# Altium project ZYNQ_JTY_16CH.PrjPcb (part 1 of 2)
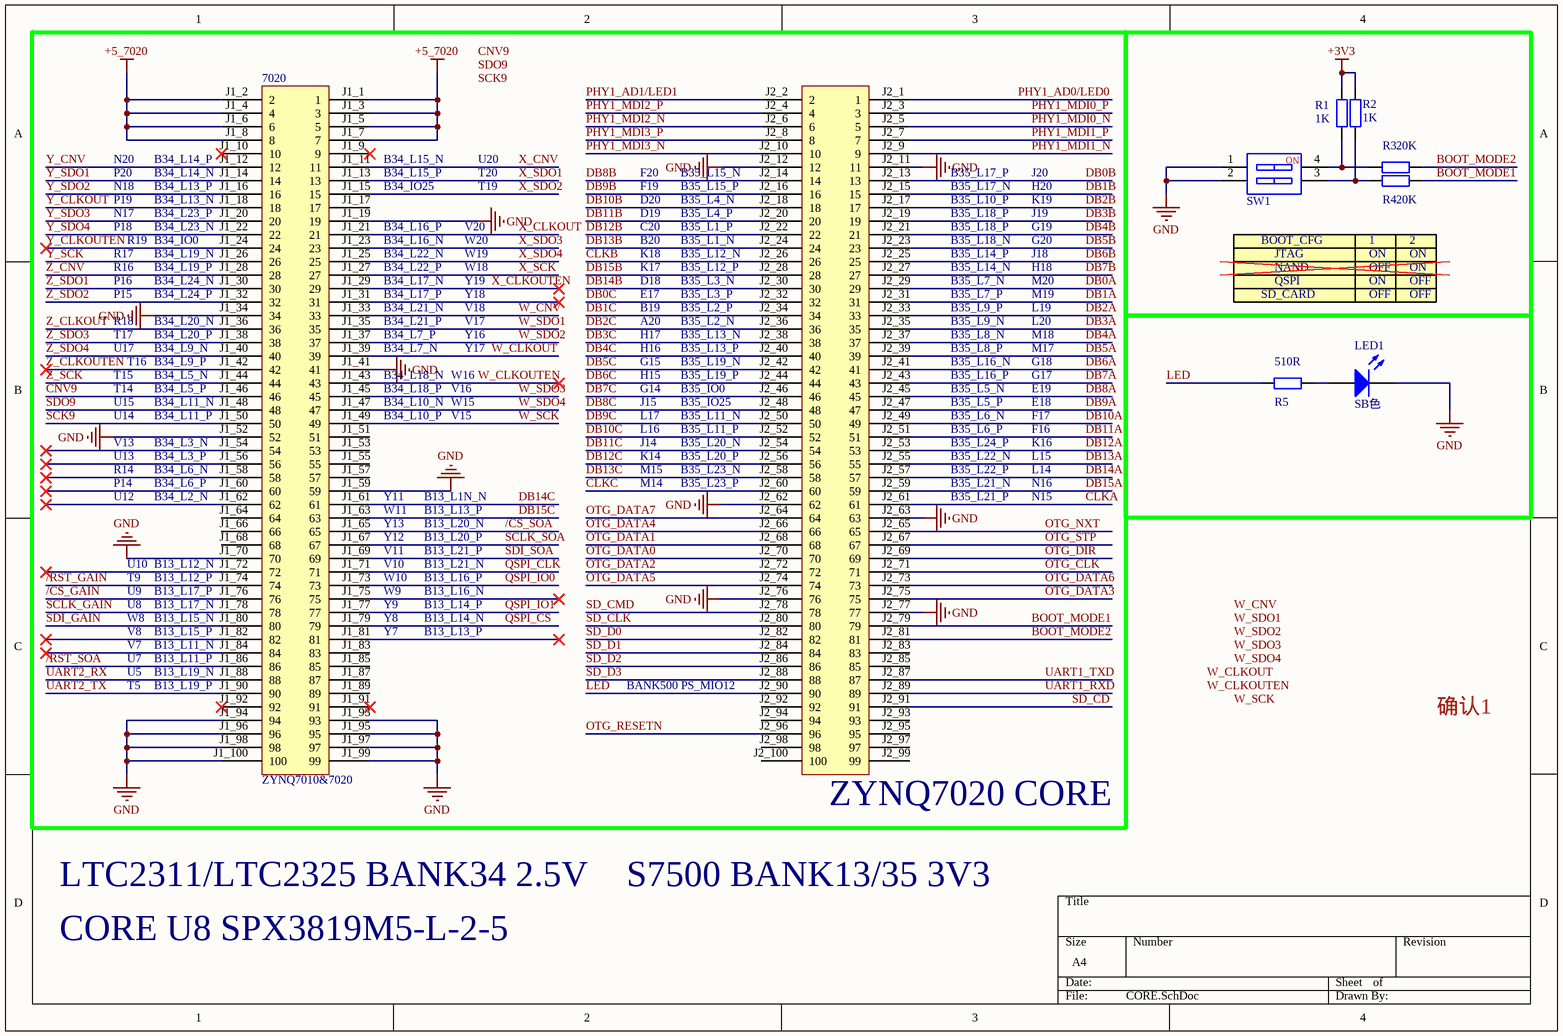
[diagram p0: CORE.SchDoc]
6 sheets, 525 parts. Net scope: global (net labels, ports and power ports of the same name join across sheets).
Board file: ZYNQ_JTY_16CH.PcbDoc
Sheets:
  CORE.SchDoc
  S7500_Drv.SchDoc
  PD.SchDoc
  PWR.SchDoc
  USB_HOST.SchDoc
  NET&232&USART&SD&FLASH.SchDoc

## Sheet CORE.SchDoc
size A4; SheetNumber: 1; SheetTotal: 6

### Parts
7020  ZYNQ7010&7020  [ZYNQ7010&7020_CB]
LED1  SB色  [LED0603_B]
R1  1K  [R0402_L]
R2  1K  [R0402_L]
R3  20K  [R0402_L]
R4  20K  [R0402_L]
R5  510R  [R0603_L]
SW1  DIP-SW-2P  [SW DIP-2P]  (value not drawn)

### Blocks framed on the sheet
ZYNQ7020 CORE: 7020

### Nets
+3V3: R1.2 R2.2
+5_7020: 7020.J1_1(1) 7020.J1_2(2) 7020.J1_3(3) 7020.J1_4(4) 7020.J1_5(5) 7020.J1_6(6) 7020.J1_7(7) 7020.J1_8(8)
GND: 7020.J1_19(19) 7020.J1_34(34) 7020.J1_41(41) 7020.J1_52(52) 7020.J1_59(59) 7020.J1_70(70) 7020.J1_93(93) 7020.J1_94(94) 7020.J1_95(95) 7020.J1_96(96) 7020.J1_97(97) 7020.J1_98(98) 7020.J1_99(99) 7020.J1_100(100) 7020.J2_11(11) 7020.J2_12(12) 7020.J2_62(62) 7020.J2_63(63) 7020.J2_76(76) 7020.J2_77(77) LED1.2(K) SW1.1 SW1.2
/CS_GAIN: 7020.J1_76(76)
/CS_SOA: 7020.J1_65(65)
/RST_GAIN: 7020.J1_74(74)
/RST_SOA: 7020.J1_86(86)
BOOT_MODE1: 7020.J2_79(79) R4.2
BOOT_MODE2: 7020.J2_81(81) R3.2
CLKA: 7020.J2_61(61)
CLKB: 7020.J2_26(26)
CLKC: 7020.J2_60(60)
CNV9: 7020.J1_46(46)
DB0A: 7020.J2_29(29)
DB0B: 7020.J2_13(13)
DB0C: 7020.J2_32(32)
DB1A: 7020.J2_31(31)
DB1B: 7020.J2_15(15)
DB1C: 7020.J2_34(34)
DB2A: 7020.J2_33(33)
DB2B: 7020.J2_17(17)
DB2C: 7020.J2_36(36)
DB3A: 7020.J2_35(35)
DB3B: 7020.J2_19(19)
DB3C: 7020.J2_38(38)
DB4A: 7020.J2_37(37)
DB4B: 7020.J2_21(21)
DB4C: 7020.J2_40(40)
DB5A: 7020.J2_39(39)
DB5B: 7020.J2_23(23)
DB5C: 7020.J2_42(42)
DB6A: 7020.J2_41(41)
DB6B: 7020.J2_25(25)
DB6C: 7020.J2_44(44)
DB7A: 7020.J2_43(43)
DB7B: 7020.J2_27(27)
DB7C: 7020.J2_46(46)
DB8A: 7020.J2_45(45)
DB8B: 7020.J2_14(14)
DB8C: 7020.J2_48(48)
DB9A: 7020.J2_47(47)
DB9B: 7020.J2_16(16)
DB9C: 7020.J2_50(50)
DB10A: 7020.J2_49(49)
DB10B: 7020.J2_18(18)
DB10C: 7020.J2_52(52)
DB11A: 7020.J2_51(51)
DB11B: 7020.J2_20(20)
DB11C: 7020.J2_54(54)
DB12A: 7020.J2_53(53)
DB12B: 7020.J2_22(22)
DB12C: 7020.J2_56(56)
DB13A: 7020.J2_55(55)
DB13B: 7020.J2_24(24)
DB13C: 7020.J2_58(58)
DB14A: 7020.J2_57(57)
DB14B: 7020.J2_30(30)
DB14C: 7020.J1_61(61)
DB15A: 7020.J2_59(59)
DB15B: 7020.J2_28(28)
DB15C: 7020.J1_63(63)
LED: 7020.J2_90(90) R5.1
OTG_CLK: 7020.J2_71(71)
OTG_DATA0: 7020.J2_70(70)
OTG_DATA1: 7020.J2_68(68)
OTG_DATA2: 7020.J2_72(72)
OTG_DATA3: 7020.J2_75(75)
OTG_DATA4: 7020.J2_66(66)
OTG_DATA5: 7020.J2_74(74)
OTG_DATA6: 7020.J2_73(73)
OTG_DATA7: 7020.J2_64(64)
OTG_DIR: 7020.J2_69(69)
OTG_NXT: 7020.J2_65(65)
OTG_RESETN: 7020.J2_96(96)
OTG_STP: 7020.J2_67(67)
PHY1_AD0/LED0: 7020.J2_1(1)
PHY1_AD1/LED1: 7020.J2_2(2)
PHY1_MDI0_N: 7020.J2_5(5)
PHY1_MDI0_P: 7020.J2_3(3)
PHY1_MDI1_N: 7020.J2_9(9)
PHY1_MDI1_P: 7020.J2_7(7)
PHY1_MDI2_N: 7020.J2_6(6)
PHY1_MDI2_P: 7020.J2_4(4)
PHY1_MDI3_N: 7020.J2_10(10)
PHY1_MDI3_P: 7020.J2_8(8)
QSPI_CLK: 7020.J1_71(71)
QSPI_CS: 7020.J1_79(79)
QSPI_IO0: 7020.J1_73(73)
QSPI_IO1: 7020.J1_77(77)
SCK9: 7020.J1_50(50)
SCLK_GAIN: 7020.J1_78(78)
SCLK_SOA: 7020.J1_67(67)
SD_CD: 7020.J2_91(91)
SD_CLK: 7020.J2_80(80)
SD_CMD: 7020.J2_78(78)
SD_D0: 7020.J2_82(82)
SD_D1: 7020.J2_84(84)
SD_D2: 7020.J2_86(86)
SD_D3: 7020.J2_88(88)
SDI_GAIN: 7020.J1_80(80)
SDI_SOA: 7020.J1_69(69)
SDO9: 7020.J1_48(48)
UART1_RXD: 7020.J2_89(89)  [project net TXD]
UART1_TXD: 7020.J2_87(87)  [project net RXD]
UART2_RX: 7020.J1_88(88)
UART2_TX: 7020.J1_90(90)
W_CLKOUT: 7020.J1_39(39)
W_CLKOUTEN: 7020.J1_43(43)
W_CNV: 7020.J1_33(33)
W_SCK: 7020.J1_49(49)
W_SDO1: 7020.J1_35(35)
W_SDO2: 7020.J1_37(37)
W_SDO3: 7020.J1_45(45)
W_SDO4: 7020.J1_47(47)
X_CLKOUT: 7020.J1_21(21)
X_CLKOUTEN: 7020.J1_29(29)
X_CNV: 7020.J1_11(11)
X_SCK: 7020.J1_27(27)
X_SDO1: 7020.J1_13(13)
X_SDO2: 7020.J1_15(15)
X_SDO3: 7020.J1_23(23)
X_SDO4: 7020.J1_25(25)
Y_CLKOUT: 7020.J1_18(18)
Y_CLKOUTEN: 7020.J1_24(24)
Y_CNV: 7020.J1_12(12)
Y_SCK: 7020.J1_26(26)
Y_SDO1: 7020.J1_14(14)
Y_SDO2: 7020.J1_16(16)
Y_SDO3: 7020.J1_20(20)
Y_SDO4: 7020.J1_22(22)
Z_CLKOUT: 7020.J1_36(36)
Z_CLKOUTEN: 7020.J1_42(42)
Z_CNV: 7020.J1_28(28)
Z_SCK: 7020.J1_44(44)
Z_SDO1: 7020.J1_30(30)
Z_SDO2: 7020.J1_32(32)
Z_SDO3: 7020.J1_38(38)
Z_SDO4: 7020.J1_40(40)
NetLED1_1: LED1.1(A) R5.2
NetR1_1: R1.1 R3.1 SW1.4
NetR2_1: R2.1 R4.1 SW1.3

Not connected (* = marked no-connect by the designer): 7020 J1_9(9)* J1_10(10)* J1_17(17) J1_31(31)* J1_51(51) J1_53(53) J1_54(54)* J1_55(55) J1_56(56)* J1_57(57) J1_58(58)* J1_60(60)* J1_62(62)* J1_64(64) J1_66(66) J1_68(68) J1_72(72)* J1_75(75)* J1_81(81)* J1_82(82)* J1_83(83) J1_84(84)* J1_85(85) J1_87(87) J1_89(89) J1_91(91)* J1_92(92)* J2_83(83) J2_85(85) J2_92(92) J2_93(93) J2_94(94) J2_95(95) J2_97(97) J2_98(98) J2_99(99) J2_100(100)

### Notes on the sheet
- N20
- P20
- (near 7020) B34_L14_P
- (near 7020) B34_L14_N
- (near 7020) B34_L15_N
- (near 7020) B34_L15_P
- (near 7020) U20
- (near 7020) T20
- (near 7020) F20
- (near 7020) B35_L15_N
- B35_L17_P
- J20
- N18
- P19
- N17
- P18
- R19
- (near 7020) B34_L13_P
- (near 7020) B34_L13_N
- (near 7020) B34_L23_P
- B34_IO0
- (near 7020) B34_L23_N
- (near 7020) B34_IO25
- (near 7020) B34_L16_P
- (near 7020) B34_L16_N
- (near 7020) V20
- (near 7020) W20
- (near 7020) T19
- (near 7020) F19
- (near 7020) D20
- (near 7020) D19
- (near 7020) C20
- (near 7020) B20
- (near 7020) B35_L15_P
- (near 7020) B35_L4_N
- (near 7020) B35_L4_P
- (near 7020) B35_L1_P
- (near 7020) B35_L1_N
- B35_L17_N
- B35_L10_P
- B35_L18_P
- B35_L18_N
- H20
- K19
- J19
- G19
- G20
- BOOT_CFG
- 1
- 2
- R17
- R16
- P16
- P15
- (near 7020) B34_L19_N
- (near 7020) B34_L19_P
- (near 7020) B34_L24_N
- (near 7020) B34_L24_P
- (near 7020) B34_L22_N
- (near 7020) B34_L22_P
- (near 7020) B34_L17_N
- (near 7020) B34_L17_P
- (near 7020) B34_L21_N
- (near 7020) W19
- (near 7020) W18
- (near 7020) Y19
- (near 7020) Y18
- (near 7020) V18
- (near 7020) K18
- (near 7020) K17
- (near 7020) D18
- (near 7020) E17
- (near 7020) B19
- (near 7020) B35_L12_N
- (near 7020) B35_L12_P
- (near 7020) B35_L3_N
- (near 7020) B35_L3_P
- (near 7020) B35_L2_P
- B35_L7_N
- B35_L7_P
- B35_L9_P
- B35_L14_P
- B35_L14_N
- M20
- M19
- L19
- J18
- H18
- SD_CARD
- JTAG
- NAND
- QSPI
- ON
- OFF
- R18
- T17
- U17
- T15
- T16
- (near 7020) B34_L20_N
- (near 7020) B34_L20_P
- B34_L9_N
- B34_L9_P
- B34_L5_N
- (near 7020) B34_L21_P
- (near 7020) B34_L7_P
- (near 7020) B34_L7_N
- (near 7020) B34_L18_N
- (near 7020) W16
- (near 7020) V17
- (near 7020) Y16
- (near 7020) Y17
- (near 7020) A20
- (near 7020) H17
- (near 7020) H16
- (near 7020) G15
- (near 7020) H15
- (near 7020) B35_L2_N
- (near 7020) B35_L13_N
- (near 7020) B35_L13_P
- (near 7020) B35_L19_N
- (near 7020) B35_L19_P
- B35_L9_N
- B35_L8_N
- B35_L8_P
- B35_L16_N
- B35_L16_P
- L20
- M18
- M17
- G18
- G17
- T14
- U15
- U14
- V13
- B34_L5_P
- (near 7020) B34_L11_N
- (near 7020) B34_L11_P
- B34_L3_N
- (near 7020) B34_L18_P
- (near 7020) B34_L10_N
- (near 7020) B34_L10_P
- (near 7020) V16
- (near 7020) W15
- (near 7020) V15
- (near 7020) G14
- (near 7020) J15
- (near 7020) L17
- (near 7020) L16
- (near 7020) J14
- (near 7020) B35_IO0
- (near 7020) B35_IO25
- (near 7020) B35_L11_N
- (near 7020) B35_L11_P
- (near 7020) B35_L20_N
- B35_L5_N
- B35_L5_P
- B35_L6_N
- B35_L6_P
- B35_L24_P
- E19
- E18
- F17
- F16
- K16
- U13
- R14
- P14
- U12
- B34_L3_P
- B34_L6_N
- B34_L6_P
- B34_L2_N
- (near 7020) Y11
- (near 7020) W11
- (near 7020) B13_L1N_N
- (near 7020) B13_L13_P
- (near 7020) K14
- (near 7020) M15
- (near 7020) M14
- (near 7020) B35_L20_P
- (near 7020) B35_L23_N
- (near 7020) B35_L23_P
- B35_L22_N
- B35_L22_P
- B35_L21_N
- B35_L21_P
- L15
- L14
- N16
- N15
- U10
- T9
- (near 7020) B13_L12_N
- (near 7020) B13_L12_P
- (near 7020) Y13
- (near 7020) Y12
- (near 7020) V11
- (near 7020) V10
- (near 7020) W10
- (near 7020) B13_L20_N
- (near 7020) B13_L20_P
- (near 7020) B13_L21_P
- (near 7020) B13_L21_N
- (near 7020) B13_L16_P
- U9
- U8
- W8
- V8
- V7
- (near 7020) B13_L17_P
- (near 7020) B13_L17_N
- (near 7020) B13_L15_N
- (near 7020) B13_L15_P
- (near 7020) B13_L11_N
- (near 7020) W9
- (near 7020) Y9
- (near 7020) Y8
- (near 7020) Y7
- (near 7020) B13_L16_N
- (near 7020) B13_L14_P
- (near 7020) B13_L14_N
- U7
- T5
- U5
- (near 7020) B13_L11_P
- (near 7020) B13_L19_N
- (near 7020) B13_L19_P
- (near 7020) BANK500 PS_MIO12
- 确认1
- LTC2311/LTC2325 BANK34 2.5V
- S7500 BANK13/35 3V3
- CORE U8 SPX3819M5-L-2-5
- Labels drawn without touching a wire or pin: CNV9, SCK9, SDO9, W_CLKOUT, W_CLKOUTEN, W_CNV, W_SCK, W_SDO1, W_SDO2, W_SDO3, W_SDO4
- (in symbol DIP-SW-2P) NO

### Library data of the parts
7020 = ZYNQ7010&7020: ZYNQ7010&7020 Core Board
LED1 = LED: 贴片LED; 封装库来自淘宝卖家：黄晶宝石: 其他店铺购入均为盗版封装库，无更新权益，请立即申请退款，本店现金奖励200~1000元; BOM名称: 贴片LED
R1-R5 = R: 贴片电阻; 联系下单店铺卖家 免费帮你查找封装: 联系下单店铺卖家 免费技术支持; BOM名称: 贴片电阻
SW1 = DIP-SW-2P: 2路拨码开关; 联系下单店铺卖家 免费技术支持: 联系下单店铺卖家 免费帮你查找封装; BOM名称: 2路拨码开关

## Sheet S7500_Drv.SchDoc
size A2; SheetNumber: 2; SheetTotal: 6
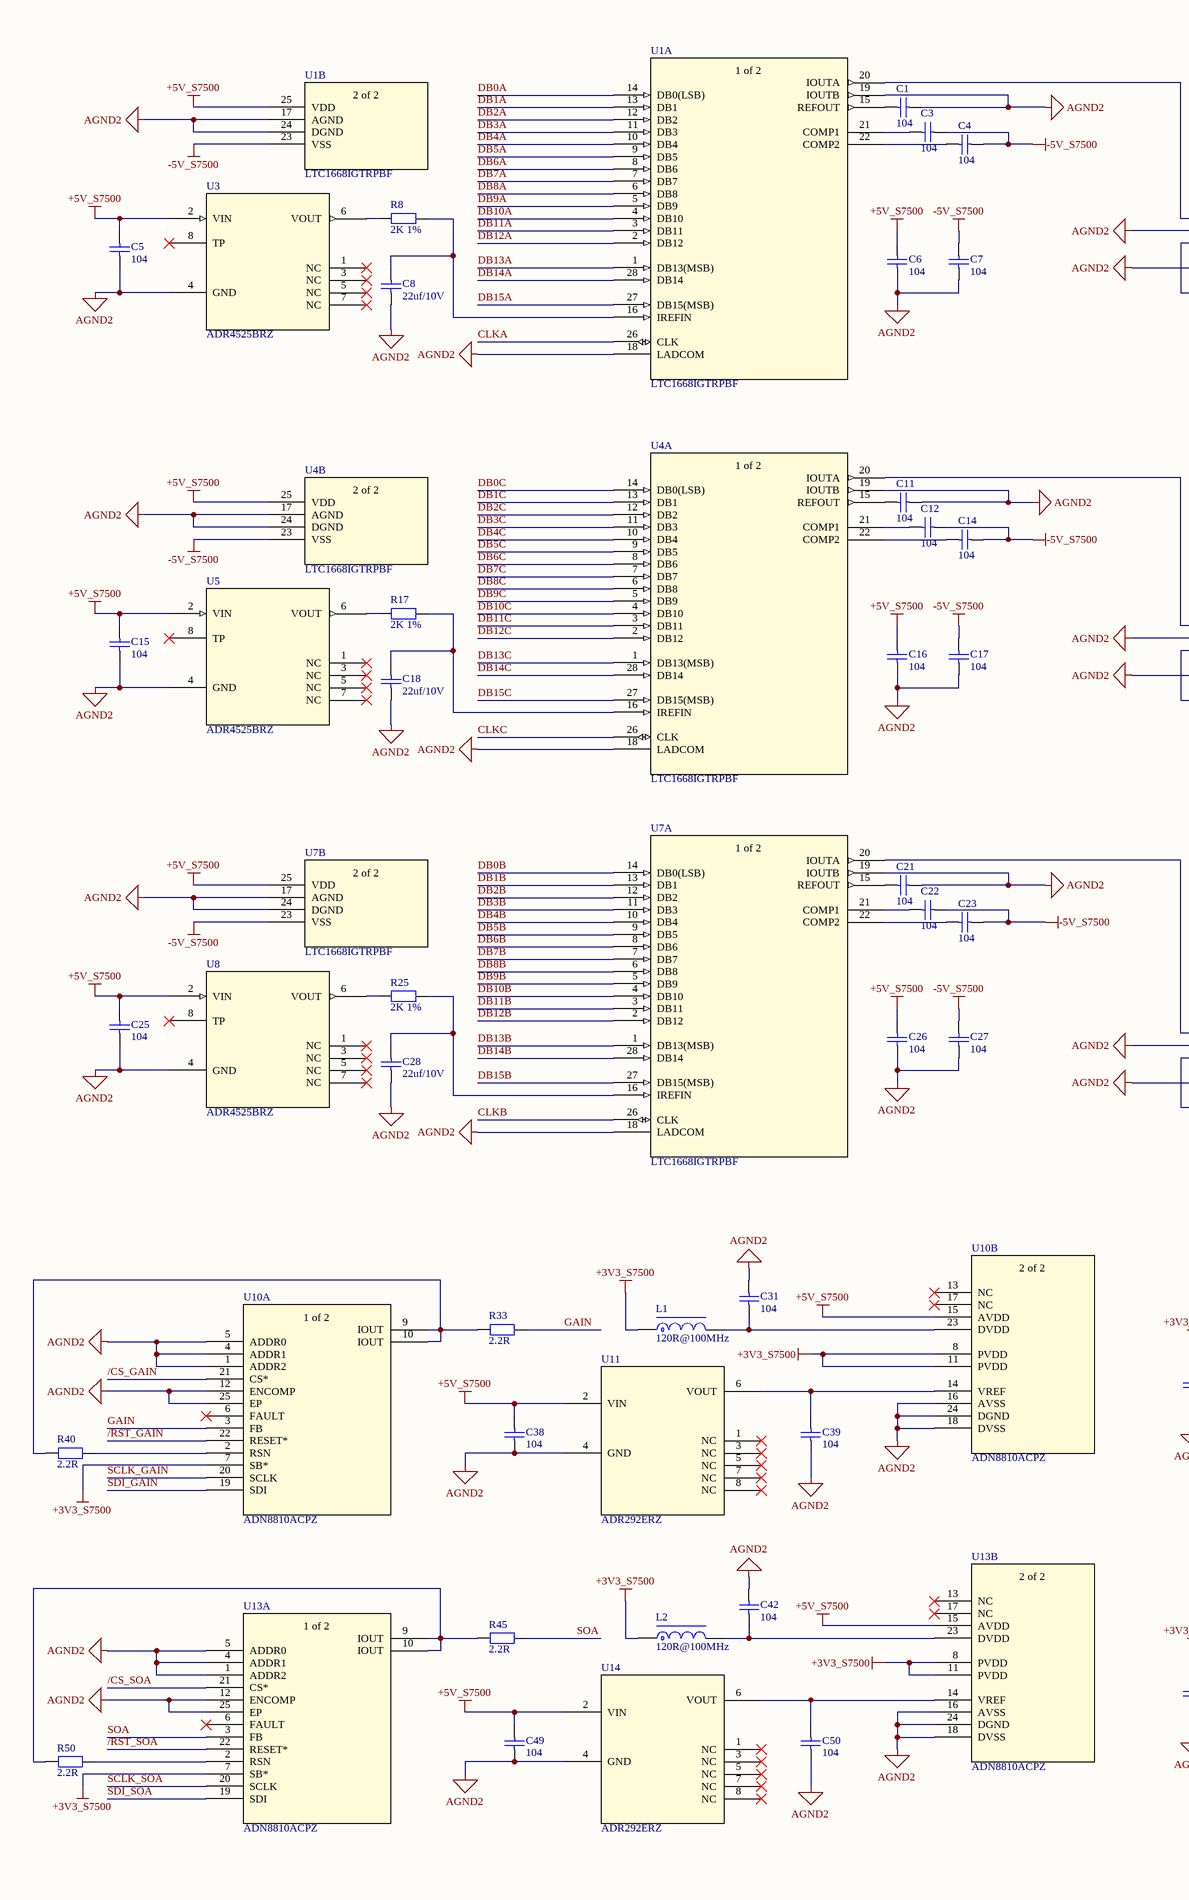
[diagram p1: S7500_Drv.SchDoc, left]
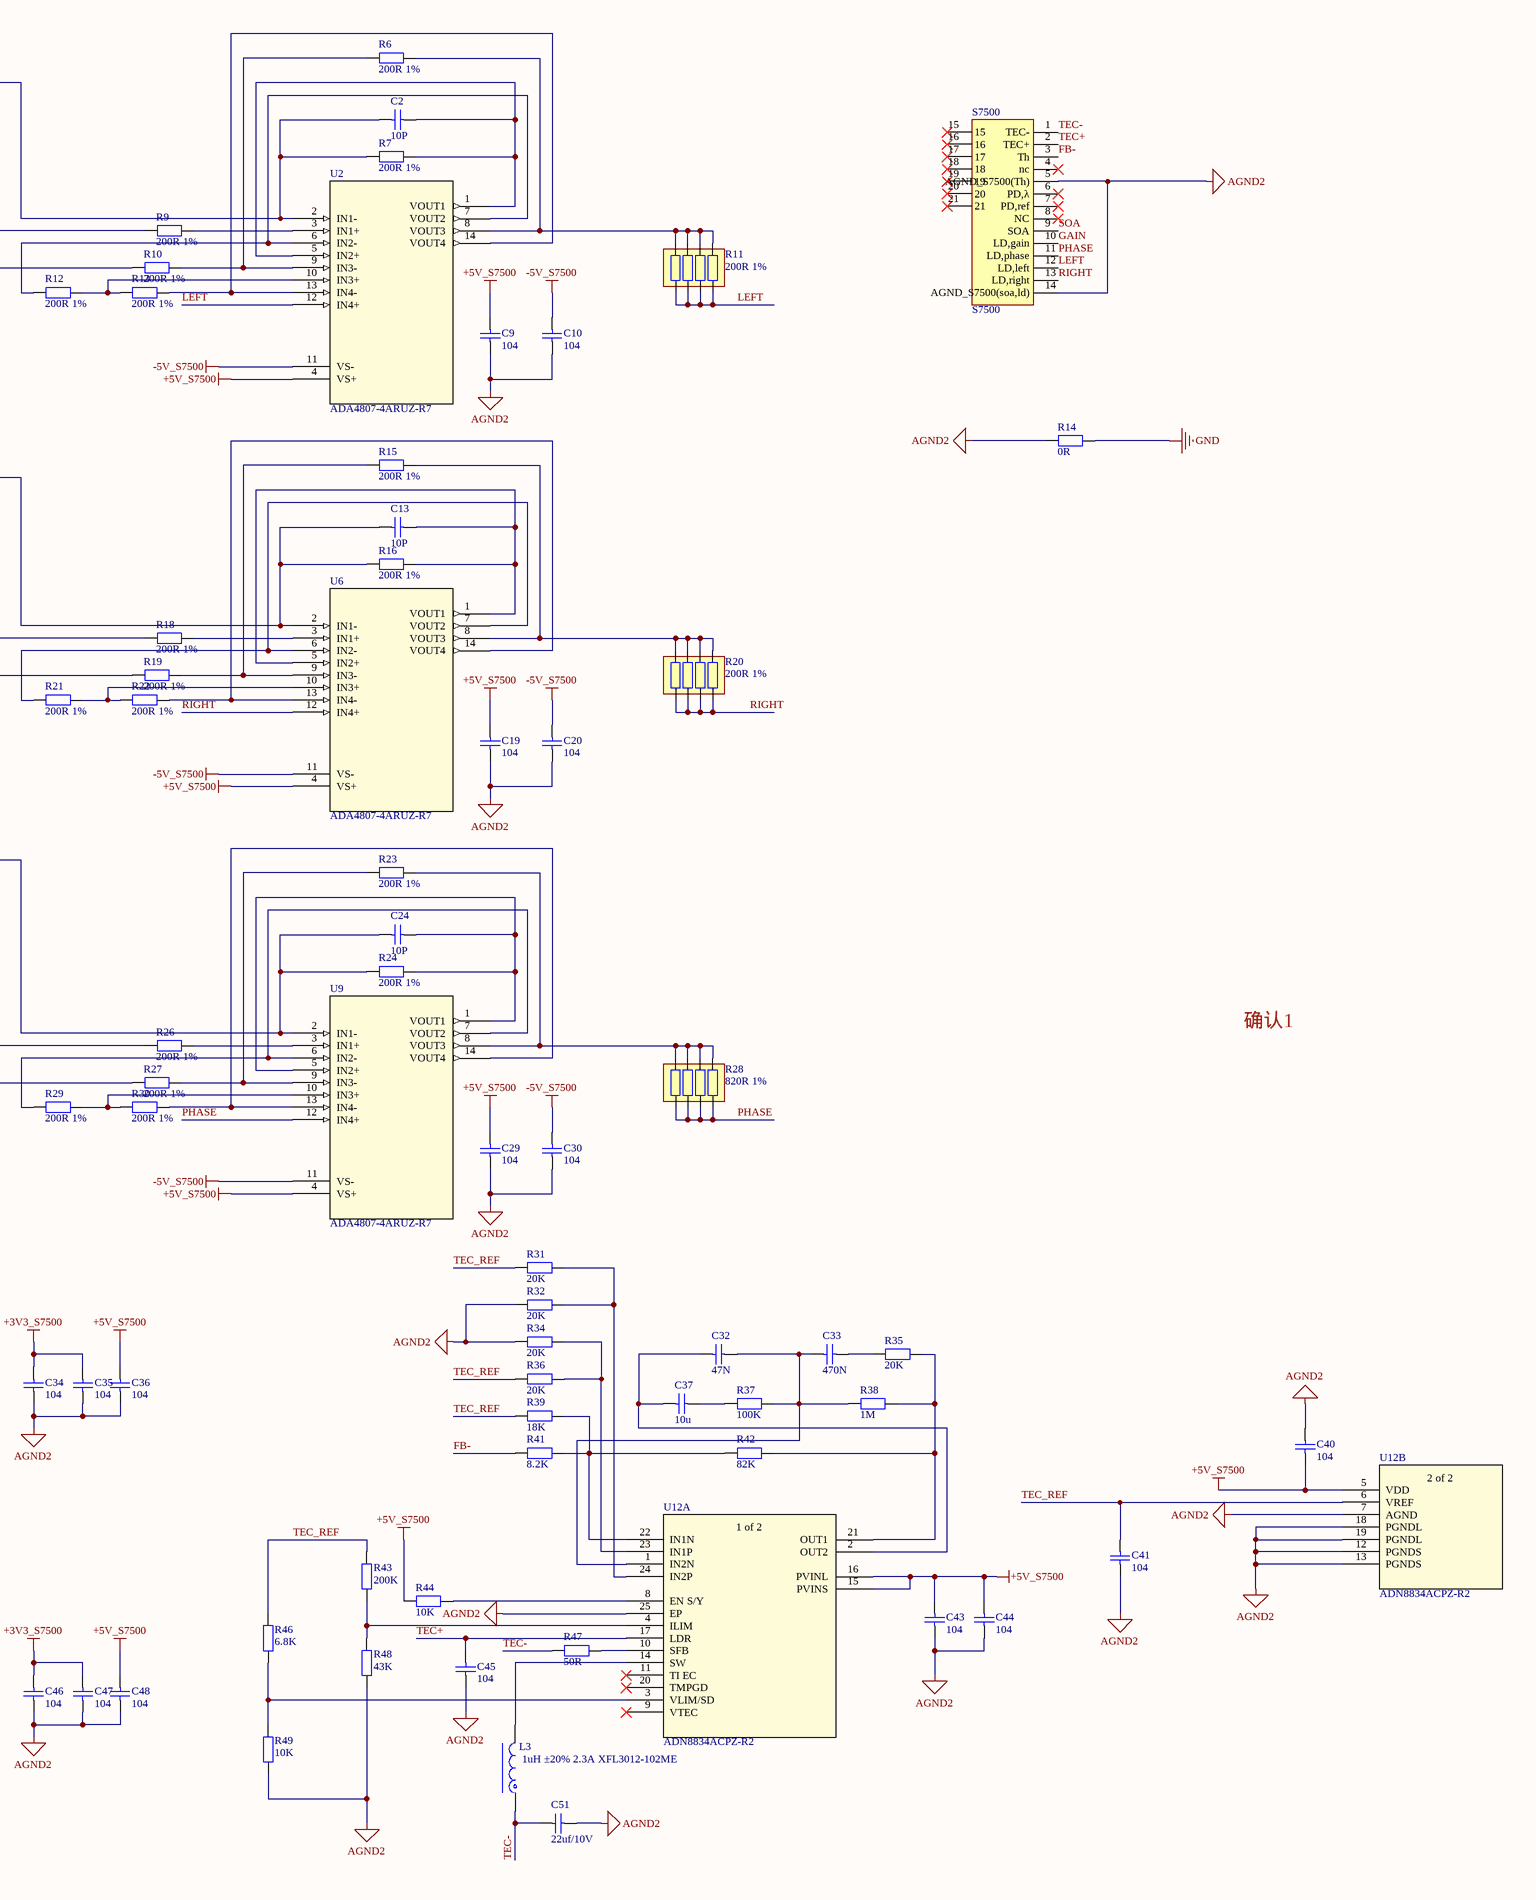
[diagram p2: S7500_Drv.SchDoc, right]

### Parts
C1  104  [C0402_L]
C2  10P  [C0402_L]
C3  104  [C0402_L]
C4  104  [C0402_L]
C5  104  [C0402_L]
C6  104  [C0402_L]
C7  104  [C0402_L]
C8  22uf/10V  [C0402_L]
C9  104  [C0402_L]
C10  104  [C0402_L]
C11  104  [C0402_L]
C12  104  [C0402_L]
C13  10P  [C0402_L]
C14  104  [C0402_L]
C15  104  [C0402_L]
C16  104  [C0402_L]
C17  104  [C0402_L]
C18  22uf/10V  [C0402_L]
C19  104  [C0402_L]
C20  104  [C0402_L]
C21  104  [C0402_L]
C22  104  [C0402_L]
C23  104  [C0402_L]
C24  10P  [C0402_L]
C25  104  [C0402_L]
C26  104  [C0402_L]
C27  104  [C0402_L]
C28  22uf/10V  [C0402_L]
C29  104  [C0402_L]
C30  104  [C0402_L]
C31  104  [C0402_L]
C32  47N  [C0402_L]
C33  470N  [C0402_L]
C34  104  [C0402_L]
C35  104  [C0402_L]
C36  104  [C0402_L]
C37  10u  [C0402_L]
C38  104  [C0402_L]
C39  104  [C0402_L]
C40  104  [C0402_L]
C41  104  [C0402_L]
C42  104  [C0402_L]
C43  104  [C0402_L]
C44  104  [C0402_L]
C45  104  [C0402_L]
C46  104  [C0402_L]
C47  104  [C0402_L]
C48  104  [C0402_L]
C49  104  [C0402_L]
C50  104  [C0402_L]
C51  22uf/10V  [C0402_L]
L1  120R@100MHz  [FB0402]
L2  120R@100MHz  [FB0402]
L3  1uH ±20% 2.3A XFL3012-102ME  [SWPA3015]
R6  200R 1%  [R0402_L]
R7  200R 1%  [R0402_L]
R8  2K 1%  [R0402_L]
R9  200R 1%  [R0402_L]
R10  200R 1%  [R0402_L]
R11  200R 1%  [RCA-8P4R-0603]
R12  200R 1%  [R0402_L]
R13  200R 1%  [R0402_L]
R14  0R  [R0402_L]
R15  200R 1%  [R0402_L]
R16  200R 1%  [R0402_L]
R17  2K 1%  [R0402_L]
R18  200R 1%  [R0402_L]
R19  200R 1%  [R0402_L]
R20  200R 1%  [RCA-8P4R-0603]
R21  200R 1%  [R0402_L]
R22  200R 1%  [R0402_L]
R23  200R 1%  [R0402_L]
R24  200R 1%  [R0402_L]
R25  2K 1%  [R0402_L]
R26  200R 1%  [R0402_L]
R27  200R 1%  [R0402_L]
R28  820R 1%  [RCA-8P4R-0603]
R29  200R 1%  [R0402_L]
R30  200R 1%  [R0402_L]
R31  20K  [R0402_L]
R32  20K  [R0402_L]
R33  2.2R  [R0603_L]
R34  20K  [R0402_L]
R35  20K  [R0402_L]
R36  20K  [R0402_L]
R37  100K  [R0402_L]
R38  1M  [R0402_L]
R39  18K  [R0402_L]
R40  2.2R  [R0603_L]
R41  8.2K  [R0402_L]
R42  82K  [R0402_L]
R43  200K  [R0402_L]
R44  10K  [R0402_L]
R45  2.2R  [R0603_L]
R46  6.8K  [R0402_L]
R47  50R  [R0402_L]
R48  43K  [R0402_L]
R49  10K  [R0402_L]
R50  2.2R  [R0603_L]
S7500  S7500  [S7500-14*0.8mm]
U1  LTC1668IGTRPBF  [SSOP-28_G_LIT]  (parts A,B of 2)
U2  ADA4807-4ARUZ-R7  [RU-14_ADI]
U3  ADR4525BRZ  [R_8_ADI]
U4  LTC1668IGTRPBF  [SSOP-28_G_LIT]  (parts A,B of 2)
U5  ADR4525BRZ  [R_8_ADI]
U6  ADA4807-4ARUZ-R7  [RU-14_ADI]
U7  LTC1668IGTRPBF  [SSOP-28_G_LIT]  (parts A,B of 2)
U8  ADR4525BRZ  [R_8_ADI]
U9  ADA4807-4ARUZ-R7  [RU-14_ADI]
U10  ADN8810ACPZ  [CP_24_1_ADI]  (parts A,B of 2)
U11  ADR292ERZ  [R_8_ADI]
U12  ADN8834ACPZ-R2  [CP_24_7_ADI]  (parts A,B of 2)
U13  ADN8810ACPZ  [CP_24_1_ADI]  (parts A,B of 2)
U14  ADR292ERZ  [R_8_ADI]

### Nets
+3V3_S7500: C34.2 C35.2 C46.2 C47.2 L1.1 L2.1 U10.7(SB*) U10.8(PVDD) U10.11(PVDD) U13.7(SB*) U13.8(PVDD) U13.11(PVDD)
+5V_S7500: C5.2 C6.2 C9.2 C15.2 C16.2 C19.2 C25.2 C26.2 C29.2 C36.2 C38.2 C40.1 C43.2 C44.2 C48.2 C49.2 R44.1 U1.25(VDD) U2.4(VS+) U3.2(VIN) U4.25(VDD) U5.2(VIN) U6.4(VS+) U7.25(VDD) U8.2(VIN) U9.4(VS+) U10.15(AVDD) U11.2(VIN) U12.5(VDD) U12.15(PVINS) U12.16(PVINL) U13.15(AVDD) U14.2(VIN)
-5V_S7500: C3.2 C4.2 C7.2 C10.2 C12.2 C14.2 C17.2 C20.2 C22.2 C23.2 C27.2 C30.2 U1.23(VSS) U2.11(VS-) U4.23(VSS) U6.11(VS-) U7.23(VSS) U9.11(VS-)
AGND2: C1.2 C5.1 C6.1 C7.1 C8.1 C9.1 C10.1 C11.2 C15.1 C16.1 C17.1 C18.1 C19.1 C20.1 C21.2 C25.1 C26.1 C27.1 C28.1 C29.1 C30.1 C31.2 C34.1 C35.1 C36.1 C38.1 C39.1 C40.2 C41.1 C42.2 C43.1 C44.1 C45.1 C46.1 C47.1 C48.1 C49.1 C50.1 C51.1 R9.1 R10.1 R14.1 R18.1 R19.1 R26.1 R27.1 R32.1 R34.1 R48.1 R49.1 S7500.5(AGND_S7500(Th)) S7500.14(AGND_S7500(soa,ld)) U1.17(AGND) U1.18(LADCOM) U1.19(IOUTB) U1.24(DGND) U3.4(GND) U4.17(AGND) U4.18(LADCOM) U4.19(IOUTB) U4.24(DGND) U5.4(GND) U7.17(AGND) U7.18(LADCOM) U7.19(IOUTB) U7.24(DGND) U8.4(GND) U10.1(ADDR2) U10.4(ADDR1) U10.5(ADDR0) U10.12(ENCOMP) U10.16(AVSS) U10.18(DVSS) U10.24(DGND) U10.25(EP) U11.4(GND) U12.7(AGND) U12.12(PGNDS) U12.13(PGNDS) U12.18(PGNDL) U12.19(PGNDL) U12.25(EP) U13.1(ADDR2) U13.4(ADDR1) U13.5(ADDR0) U13.12(ENCOMP) U13.16(AVSS) U13.18(DVSS) U13.24(DGND) U13.25(EP) U14.4(GND)
GND: R14.2
/CS_GAIN: U10.21(CS*)
/CS_SOA: U13.21(CS*)
/RST_GAIN: U10.22(RESET*)
/RST_SOA: U13.22(RESET*)
CLKA: U1.26(CLK)
CLKB: U7.26(CLK)
CLKC: U4.26(CLK)
DB0A: U1.14(DB0(LSB))
DB0B: U7.14(DB0(LSB))
DB0C: U4.14(DB0(LSB))
DB1A: U1.13(DB1)
DB1B: U7.13(DB1)
DB1C: U4.13(DB1)
DB2A: U1.12(DB2)
DB2B: U7.12(DB2)
DB2C: U4.12(DB2)
DB3A: U1.11(DB3)
DB3B: U7.11(DB3)
DB3C: U4.11(DB3)
DB4A: U1.10(DB4)
DB4B: U7.10(DB4)
DB4C: U4.10(DB4)
DB5A: U1.9(DB5)
DB5B: U7.9(DB5)
DB5C: U4.9(DB5)
DB6A: U1.8(DB6)
DB6B: U7.8(DB6)
DB6C: U4.8(DB6)
DB7A: U1.7(DB7)
DB7B: U7.7(DB7)
DB7C: U4.7(DB7)
DB8A: U1.6(DB8)
DB8B: U7.6(DB8)
DB8C: U4.6(DB8)
DB9A: U1.5(DB9)
DB9B: U7.5(DB9)
DB9C: U4.5(DB9)
DB10A: U1.4(DB10)
DB10B: U7.4(DB10)
DB10C: U4.4(DB10)
DB11A: U1.3(DB11)
DB11B: U7.3(DB11)
DB11C: U4.3(DB11)
DB12A: U1.2(DB12)
DB12B: U7.2(DB12)
DB12C: U4.2(DB12)
DB13A: U1.1(DB13(MSB))
DB13B: U7.1(DB13(MSB))
DB13C: U4.1(DB13(MSB))
DB14A: U1.28(DB14)
DB14B: U7.28(DB14)
DB14C: U4.28(DB14)
DB15A: U1.27(DB15(MSB))
DB15B: U7.27(DB15(MSB))
DB15C: U4.27(DB15(MSB))
FB-: R41.1 S7500.3(Th)
GAIN: R33.2 S7500.10(LD,gain) U10.3(FB)
LEFT: R11.1 R11.2 R11.3 R11.4 S7500.12(LD,left) U2.12(IN4+)
PHASE: R28.1 R28.2 R28.3 R28.4 S7500.11(LD,phase) U9.12(IN4+)
RIGHT: R20.1 R20.2 R20.3 R20.4 S7500.13(LD,right) U6.12(IN4+)
SCLK_GAIN: U10.20(SCLK)
SCLK_SOA: U13.20(SCLK)
SDI_GAIN: U10.19(SDI)
SDI_SOA: U13.19(SDI)
SOA: R45.2 S7500.9(SOA) U13.3(FB)
TEC+: C45.2 S7500.2(TEC+) U12.17(LDR)
TEC-: C51.2 L3.1 R47.1 S7500.1(TEC-)
TEC_REF: C41.2 R31.1 R36.1 R39.1 R43.2 R46.2 U12.6(VREF)
NetC1_1: C1.1 U1.15(REFOUT)
NetC2_1: C2.1 R7.1 U1.20(IOUTA) U2.2(IN1-)
NetC2_2: C2.2 R7.2 U2.1(VOUT1) U2.5(IN2+)
NetC3_1: C3.1 U1.21(COMP1)
NetC4_1: C4.1 U1.22(COMP2)
NetC8_2: C8.2 R8.2 U1.16(IREFIN)
NetC11_1: C11.1 U4.15(REFOUT)
NetC12_1: C12.1 U4.21(COMP1)
NetC13_1: C13.1 R16.1 U4.20(IOUTA) U6.2(IN1-)
NetC13_2: C13.2 R16.2 U6.1(VOUT1) U6.5(IN2+)
NetC14_1: C14.1 U4.22(COMP2)
NetC18_2: C18.2 R17.2 U4.16(IREFIN)
NetC21_1: C21.1 U7.15(REFOUT)
NetC22_1: C22.1 U7.21(COMP1)
NetC23_1: C23.1 U7.22(COMP2)
NetC24_1: C24.1 R24.1 U7.20(IOUTA) U9.2(IN1-)
NetC24_2: C24.2 R24.2 U9.1(VOUT1) U9.5(IN2+)
NetC28_2: C28.2 R25.2 U7.16(IREFIN)
NetC31_1: C31.1 L1.2 U10.23(DVDD)
NetC32_1: C32.1 C33.2 R37.2 R38.1 U12.1(IN2N)
NetC32_2: C32.2 C37.2 U12.2(OUT2)
NetC33_1: C33.1 R35.1
NetC37_1: C37.1 R37.1
NetC39_2: C39.2 U10.14(VREF) U11.6(VOUT)
NetC42_1: C42.1 L2.2 U13.23(DVDD)
NetC50_2: C50.2 U13.14(VREF) U14.6(VOUT)
NetL3_2: L3.2 U12.14(SW)
NetR6_1: R6.1 R10.2 U2.9(IN3-)
NetR6_2: R6.2 R11.5 R11.6 R11.7 R11.8 U2.8(VOUT3)
NetR8_1: R8.1 U3.6(VOUT)
NetR9_2: R9.2 U2.3(IN1+)
NetR12_1: R12.1 U2.6(IN2-) U2.7(VOUT2)
NetR12_2: R12.2 R13.1 U2.10(IN3+)
NetR13_2: R13.2 U2.13(IN4-) U2.14(VOUT4)
NetR15_1: R15.1 R19.2 U6.9(IN3-)
NetR15_2: R15.2 R20.5 R20.6 R20.7 R20.8 U6.8(VOUT3)
NetR17_1: R17.1 U5.6(VOUT)
NetR18_2: R18.2 U6.3(IN1+)
NetR21_1: R21.1 U6.6(IN2-) U6.7(VOUT2)
NetR21_2: R21.2 R22.1 U6.10(IN3+)
NetR22_2: R22.2 U6.13(IN4-) U6.14(VOUT4)
NetR23_1: R23.1 R27.2 U9.9(IN3-)
NetR23_2: R23.2 R28.5 R28.6 R28.7 R28.8 U9.8(VOUT3)
NetR25_1: R25.1 U8.6(VOUT)
NetR26_2: R26.2 U9.3(IN1+)
NetR29_1: R29.1 U9.6(IN2-) U9.7(VOUT2)
NetR29_2: R29.2 R30.1 U9.10(IN3+)
NetR30_2: R30.2 U9.13(IN4-) U9.14(VOUT4)
NetR31_2: R31.2 R32.2 U12.24(IN2P)
NetR33_1: R33.1 R40.1 U10.9(IOUT) U10.10(IOUT)
NetR34_2: R34.2 R36.2 U12.23(IN1P)
NetR35_2: R35.2 R38.2 R42.2 U12.21(OUT1)
NetR39_2: R39.2 R41.2 R42.1 U12.22(IN1N)
NetR40_2: R40.2 U10.2(RSN)
NetR43_1: R43.1 R48.2 U12.4(ILIM)
NetR44_2: R44.2 U12.8(EN_S/Y)
NetR45_1: R45.1 R50.1 U13.9(IOUT) U13.10(IOUT)
NetR46_1: R46.1 R49.2 U12.3(VLIM/SD)
NetR47_2: R47.2 U12.10(SFB)
NetR50_2: R50.2 U13.2(RSN)

Not connected (* = marked no-connect by the designer): S7500 4(nc)* 6(PD,λ)* 7(PD,ref)* 8(NC)* 15* 16* 17* 18* 19* 20* 21*; U3 1(NC)* 3(NC)* 5(NC)* 7(NC)* 8(TP)*; U5 1(NC)* 3(NC)* 5(NC)* 7(NC)* 8(TP)*; U8 1(NC)* 3(NC)* 5(NC)* 7(NC)* 8(TP)*; U10 6(FAULT)* 13(NC)* 17(NC)*; U11 1(NC)* 3(NC)* 5(NC)* 7(NC)* 8(NC)*; U12 9(VTEC)* 11(TI_EC)* 20(TMPGD)*; U13 6(FAULT)* 13(NC)* 17(NC)*; U14 1(NC)* 3(NC)* 5(NC)* 7(NC)* 8(NC)*

### Notes on the sheet
- 确认1
- (in symbol ADN8810ACPZ, part A) 1 of 2
- (in symbol ADN8810ACPZ, part B) 2 of 2
- (in symbol ADN8834ACPZ-R2, part A) 1 of 2
- (in symbol ADN8834ACPZ-R2, part B) 2 of 2
- (in symbol LTC1668IGTRPBF, part A) 1 of 2
- (in symbol LTC1668IGTRPBF, part B) 2 of 2

### Library data of the parts
C1-C51 = C: 贴片电容/MLCC电容; BOM名称: 无极性贴片电容; 当前库版本V2023.5.31 @淘宝卖家:黄晶宝石: 最新版本发布https://item.taobao.com/item.htm?id=566775463719
L1 L2 = FB: 贴片磁珠; BOM名称: 直插磁珠; 联系下单店铺卖家 免费帮你查找封装: 联系下单店铺卖家 免费技术支持
L3 = L-SWPA: 顺络_SWPA贴片屏蔽电感; BOM名称: 功率屏蔽电感; 当前库版本V2023.5.31 @淘宝卖家:黄晶宝石: 最新版本发布https://item.taobao.com/item.htm?id=566775463719
R6-R10 R12-R19 R21-R27 R29-R50 = R: 贴片电阻; 联系下单店铺卖家 免费帮你查找封装: 联系下单店铺卖家 免费技术支持; BOM名称: 贴片电阻
R11 R20 R28 = R-8P4R: 贴片4P排阻; BOM名称: 贴片网络排阻; 当前库版本V2023.5.31 @淘宝卖家:黄晶宝石: 最新版本发布https://item.taobao.com/item.htm?id=566775463719
U1 U4 U7 = LTC1668IGTRPBF: No Description Available; Mfr_Name: Analog Devices Inc; RefDes: RefDes; Type: Type
U2 U6 U9 = ADA4807-4ARUZ-R7: No Description Available; Mfr_Name: Analog Devices Inc; Type: Linear; RefDes: RefDes
U3 U5 U8 = ADR4525BRZ: No Description Available; Mfr_Name: Analog Devices Inc; RefDes: RefDes; Type: Type
U10 U13 = ADN8810ACPZ: No Description Available; Mfr_Name: Analog Devices Inc; RefDes: RefDes; Type: Type
U11 U14 = ADR292ERZ: No Description Available; Mfr_Name: Analog Devices Inc; RefDes: RefDes; Type: Type
U12 = ADN8834ACPZ-R2: No Description Available; Mfr_Name: Analog Devices Inc; RefDes: RefDes; Type: Type

## Sheet PD.SchDoc
size A0; SheetNumber: 3; SheetTotal: 6
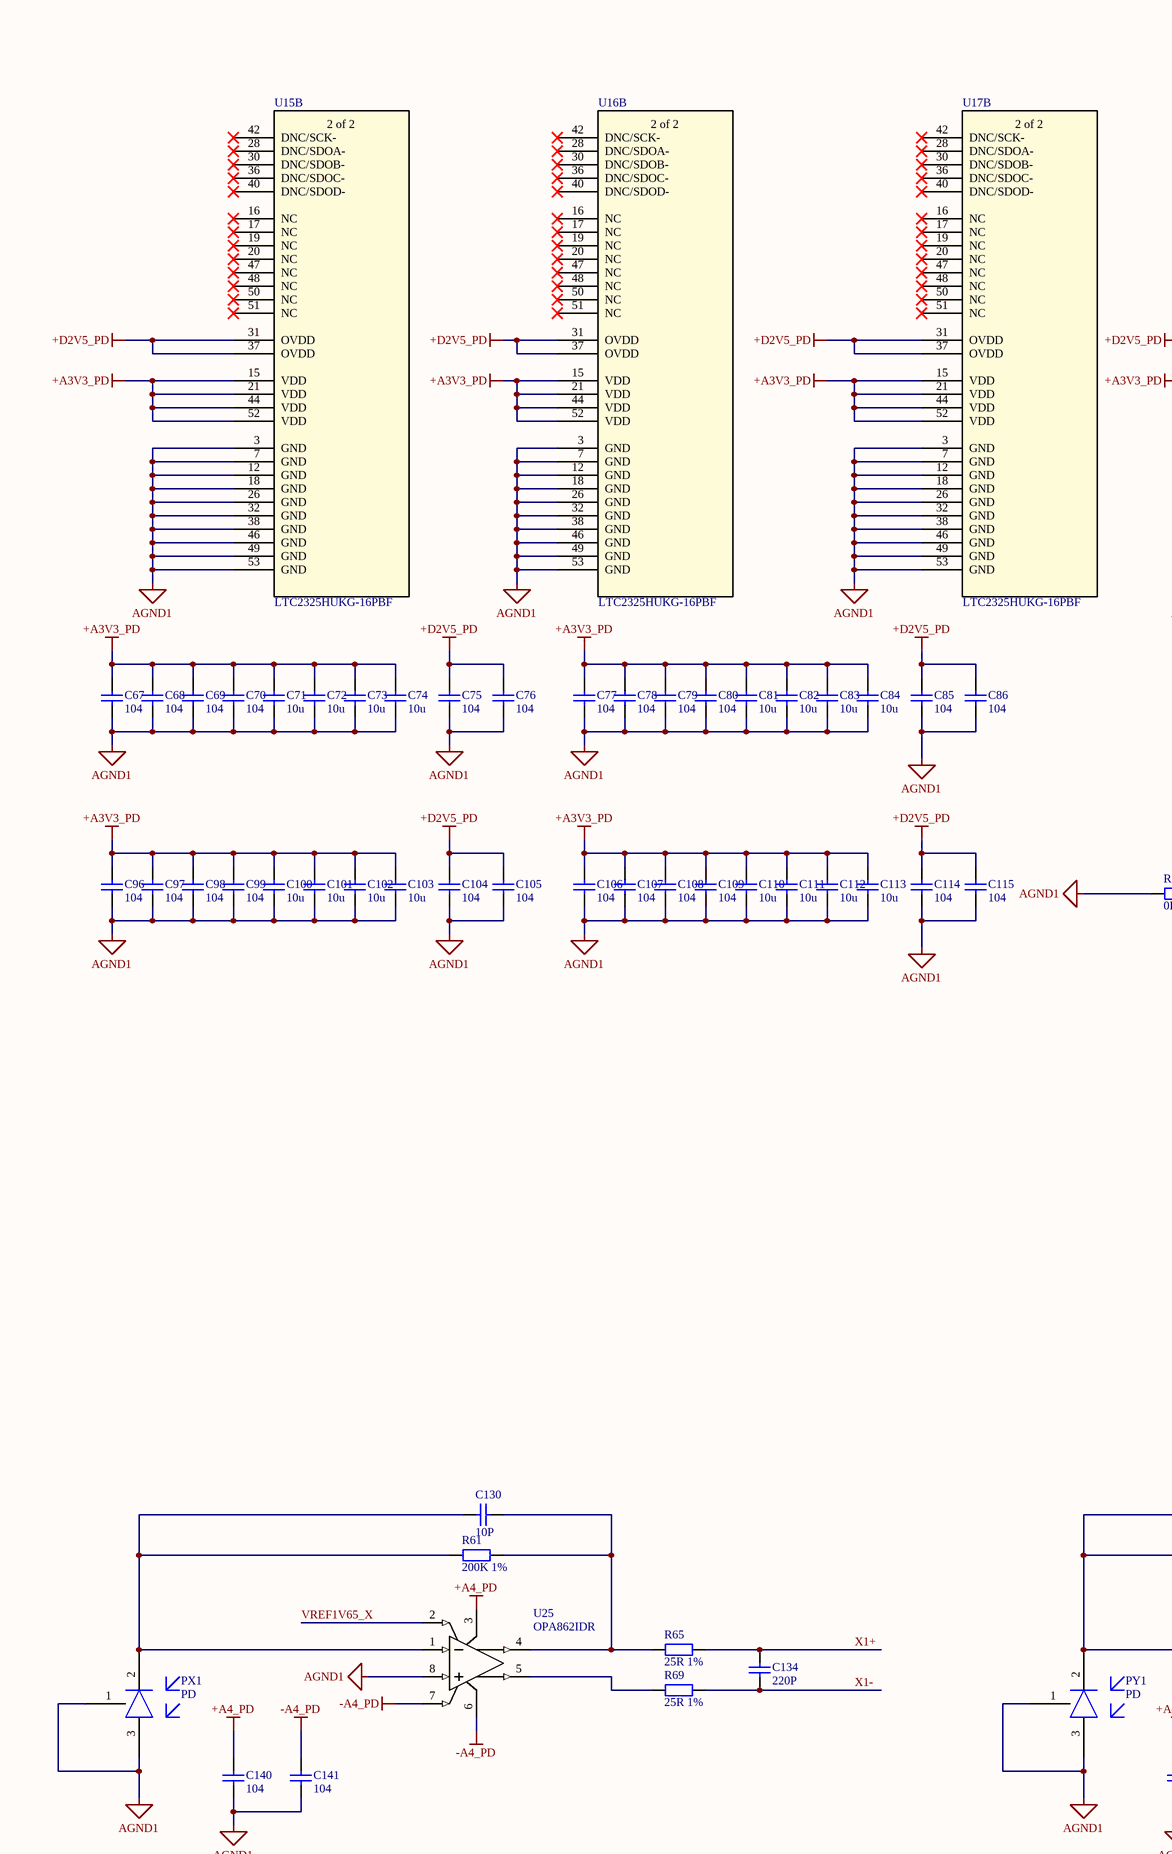
[diagram p3: PD.SchDoc, top left]
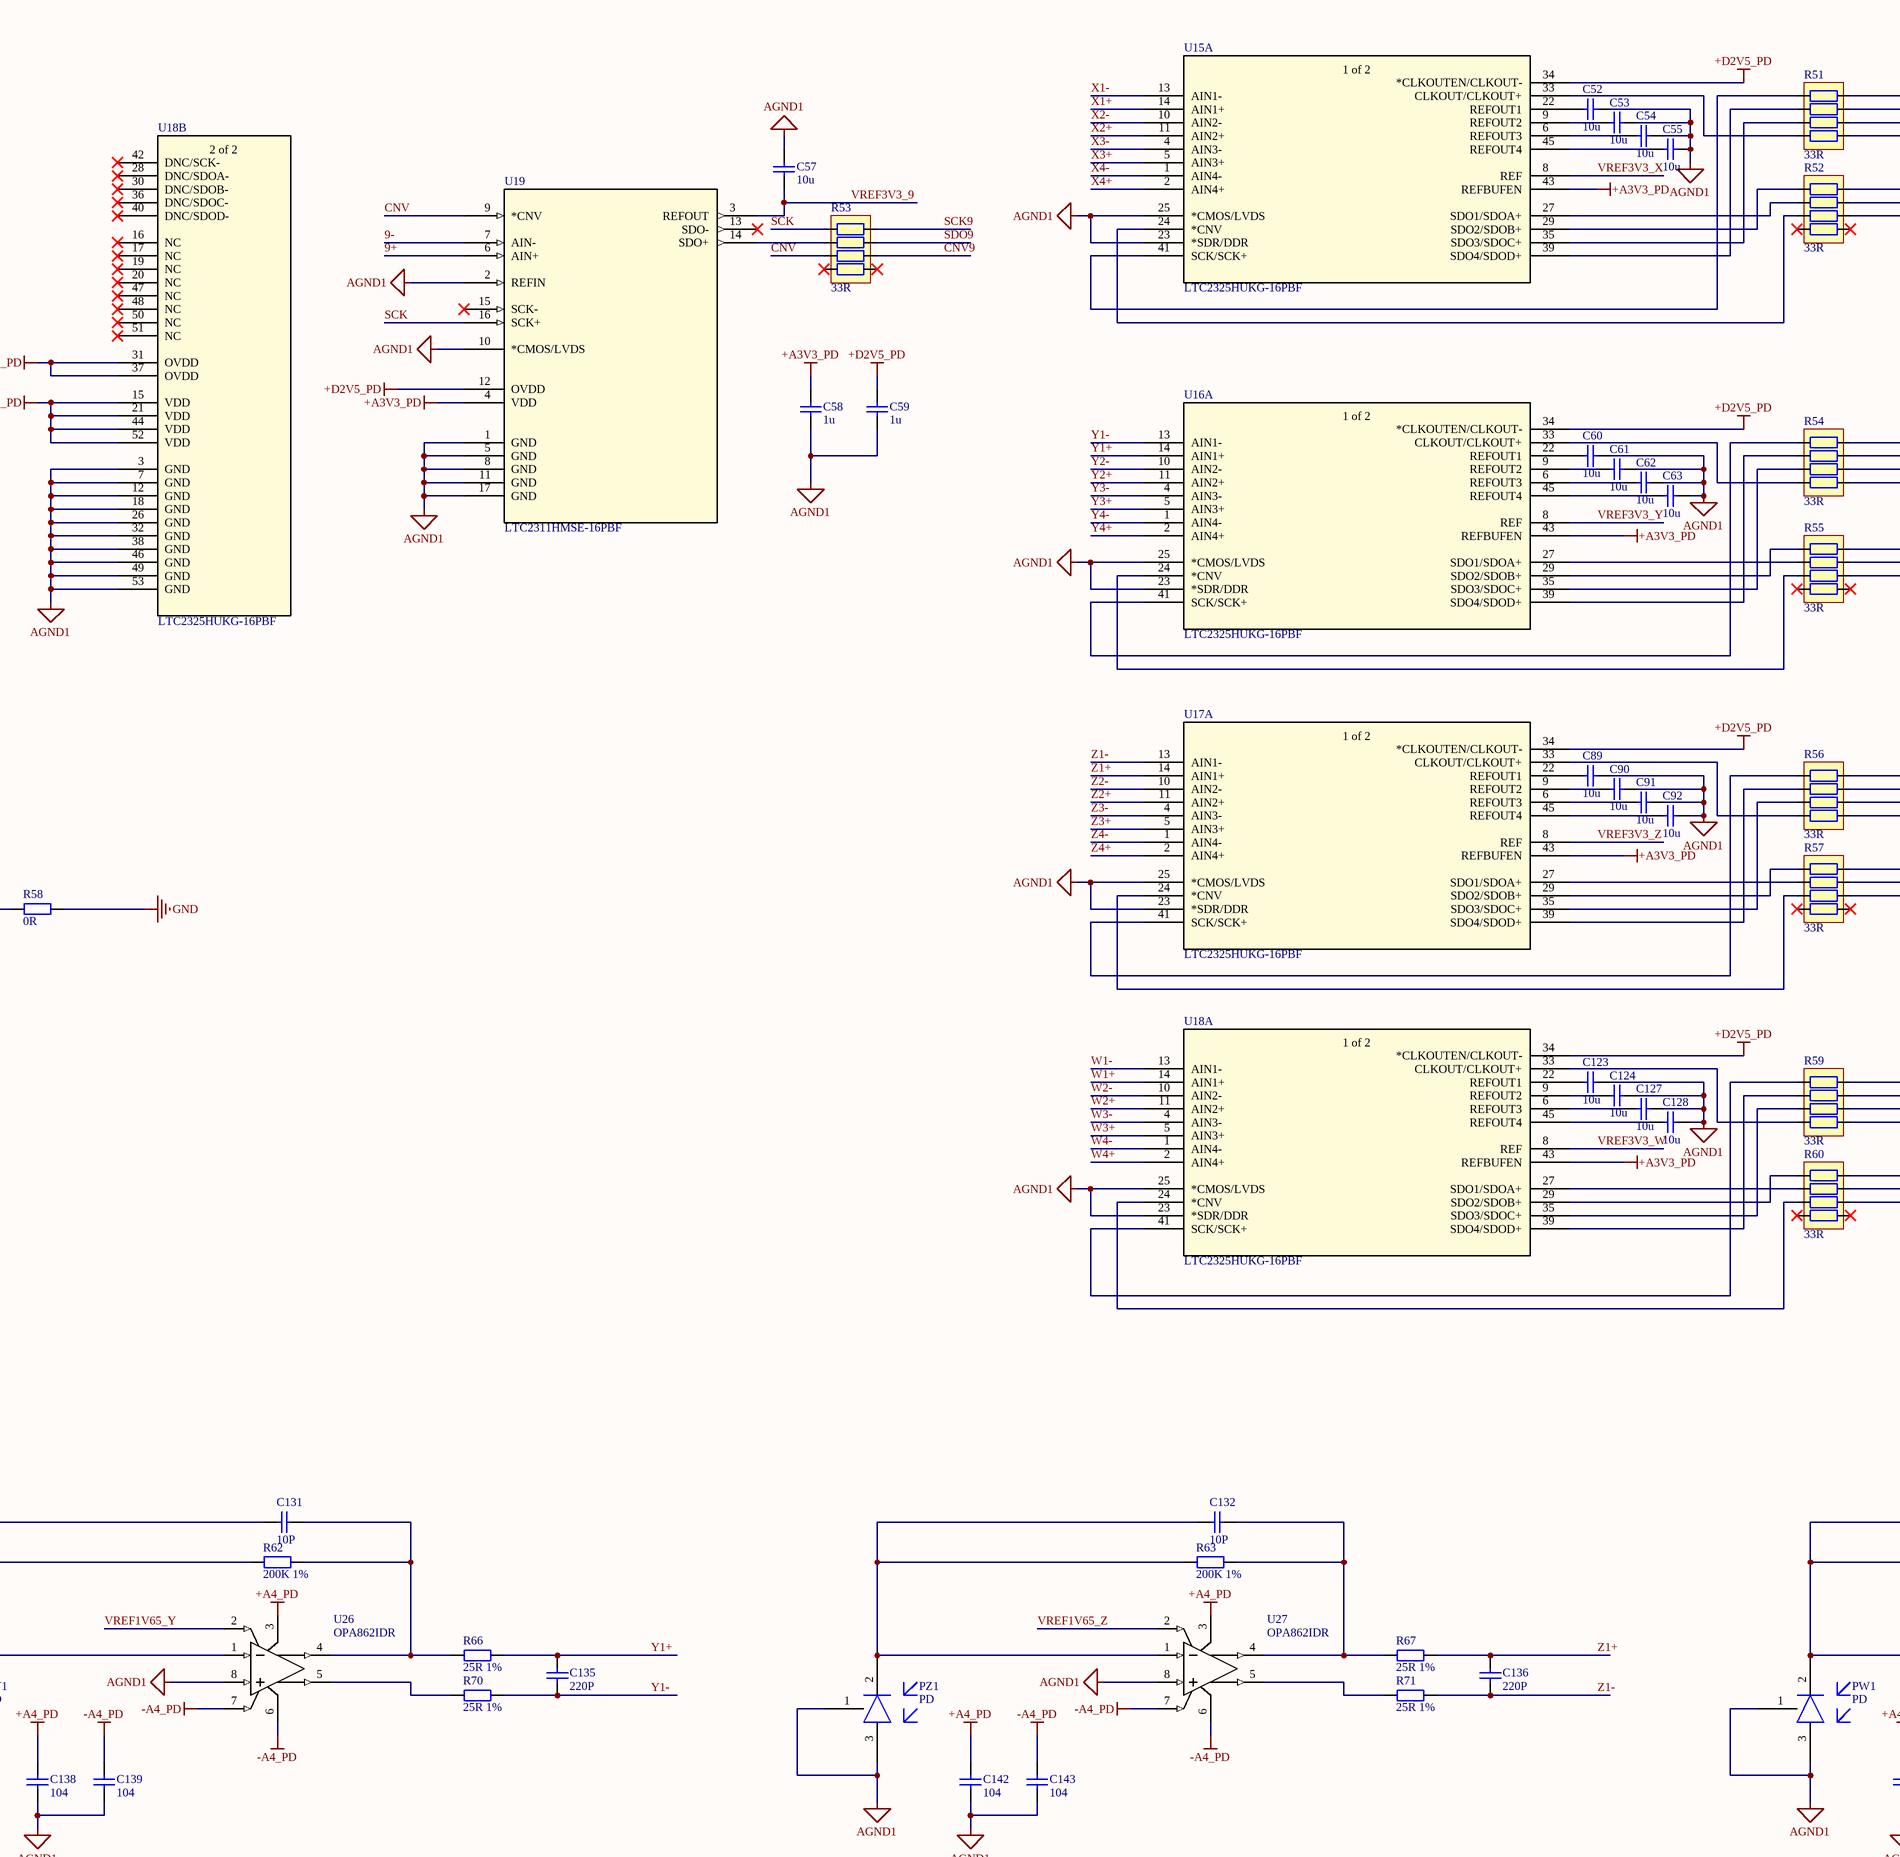
[diagram p4: PD.SchDoc, top middle]
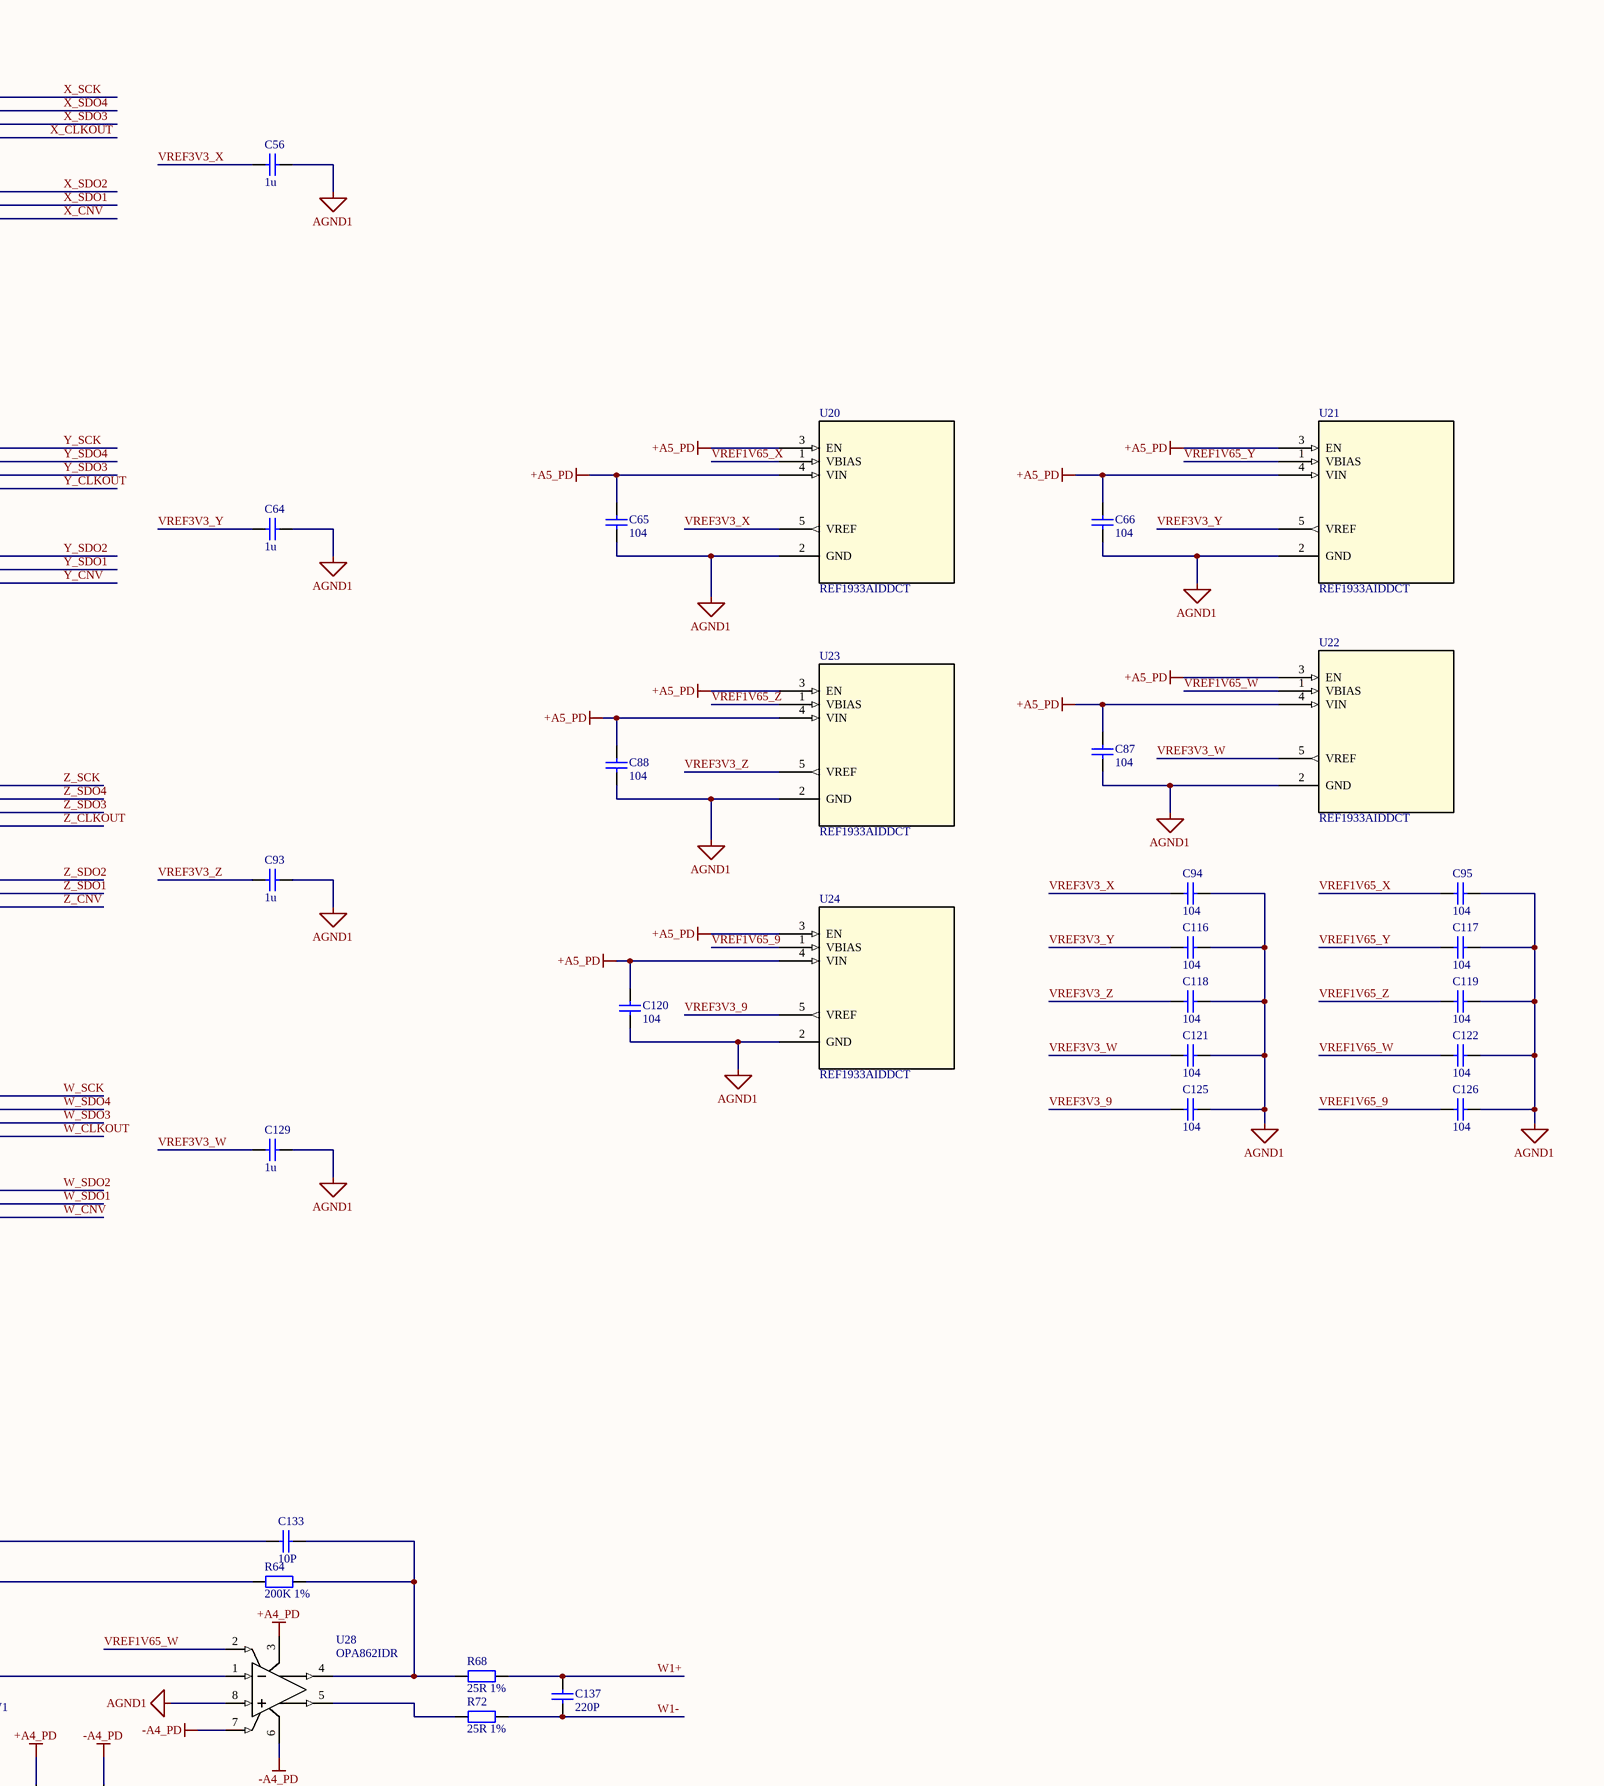
[diagram p5: PD.SchDoc, top right]
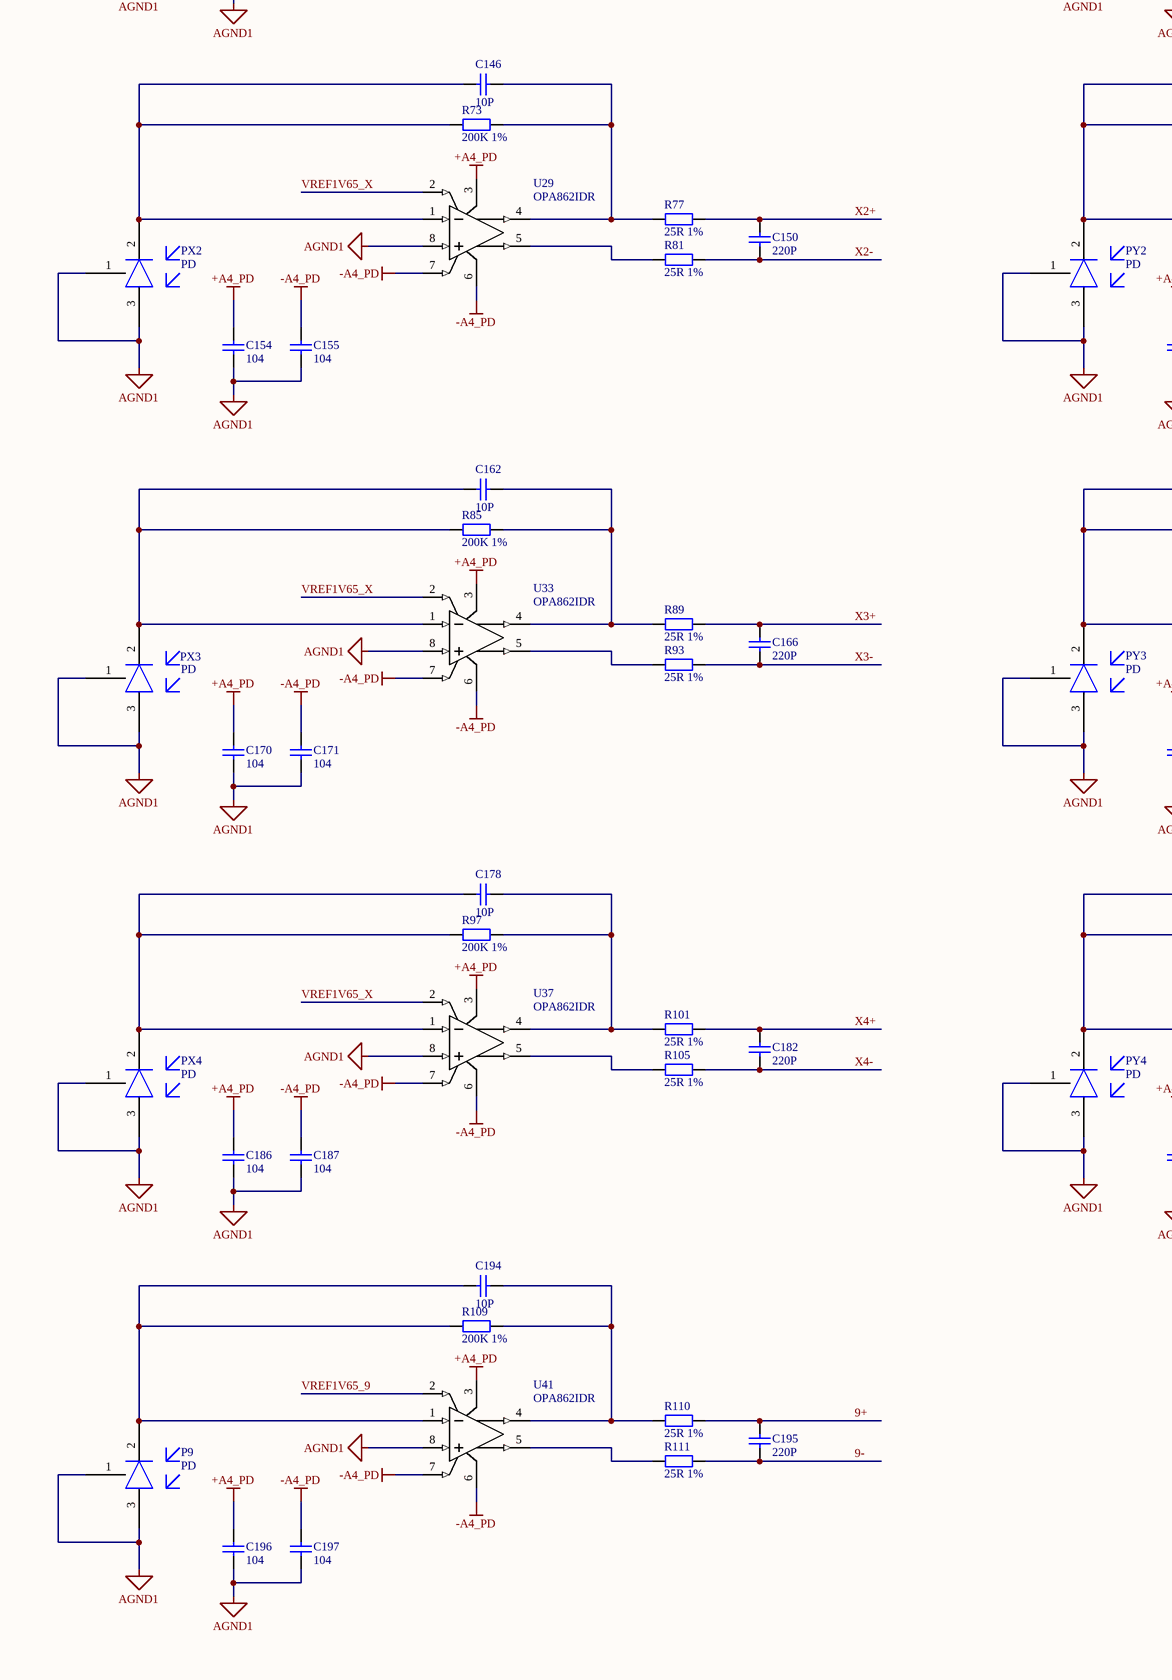
[diagram p6: PD.SchDoc, bottom left]
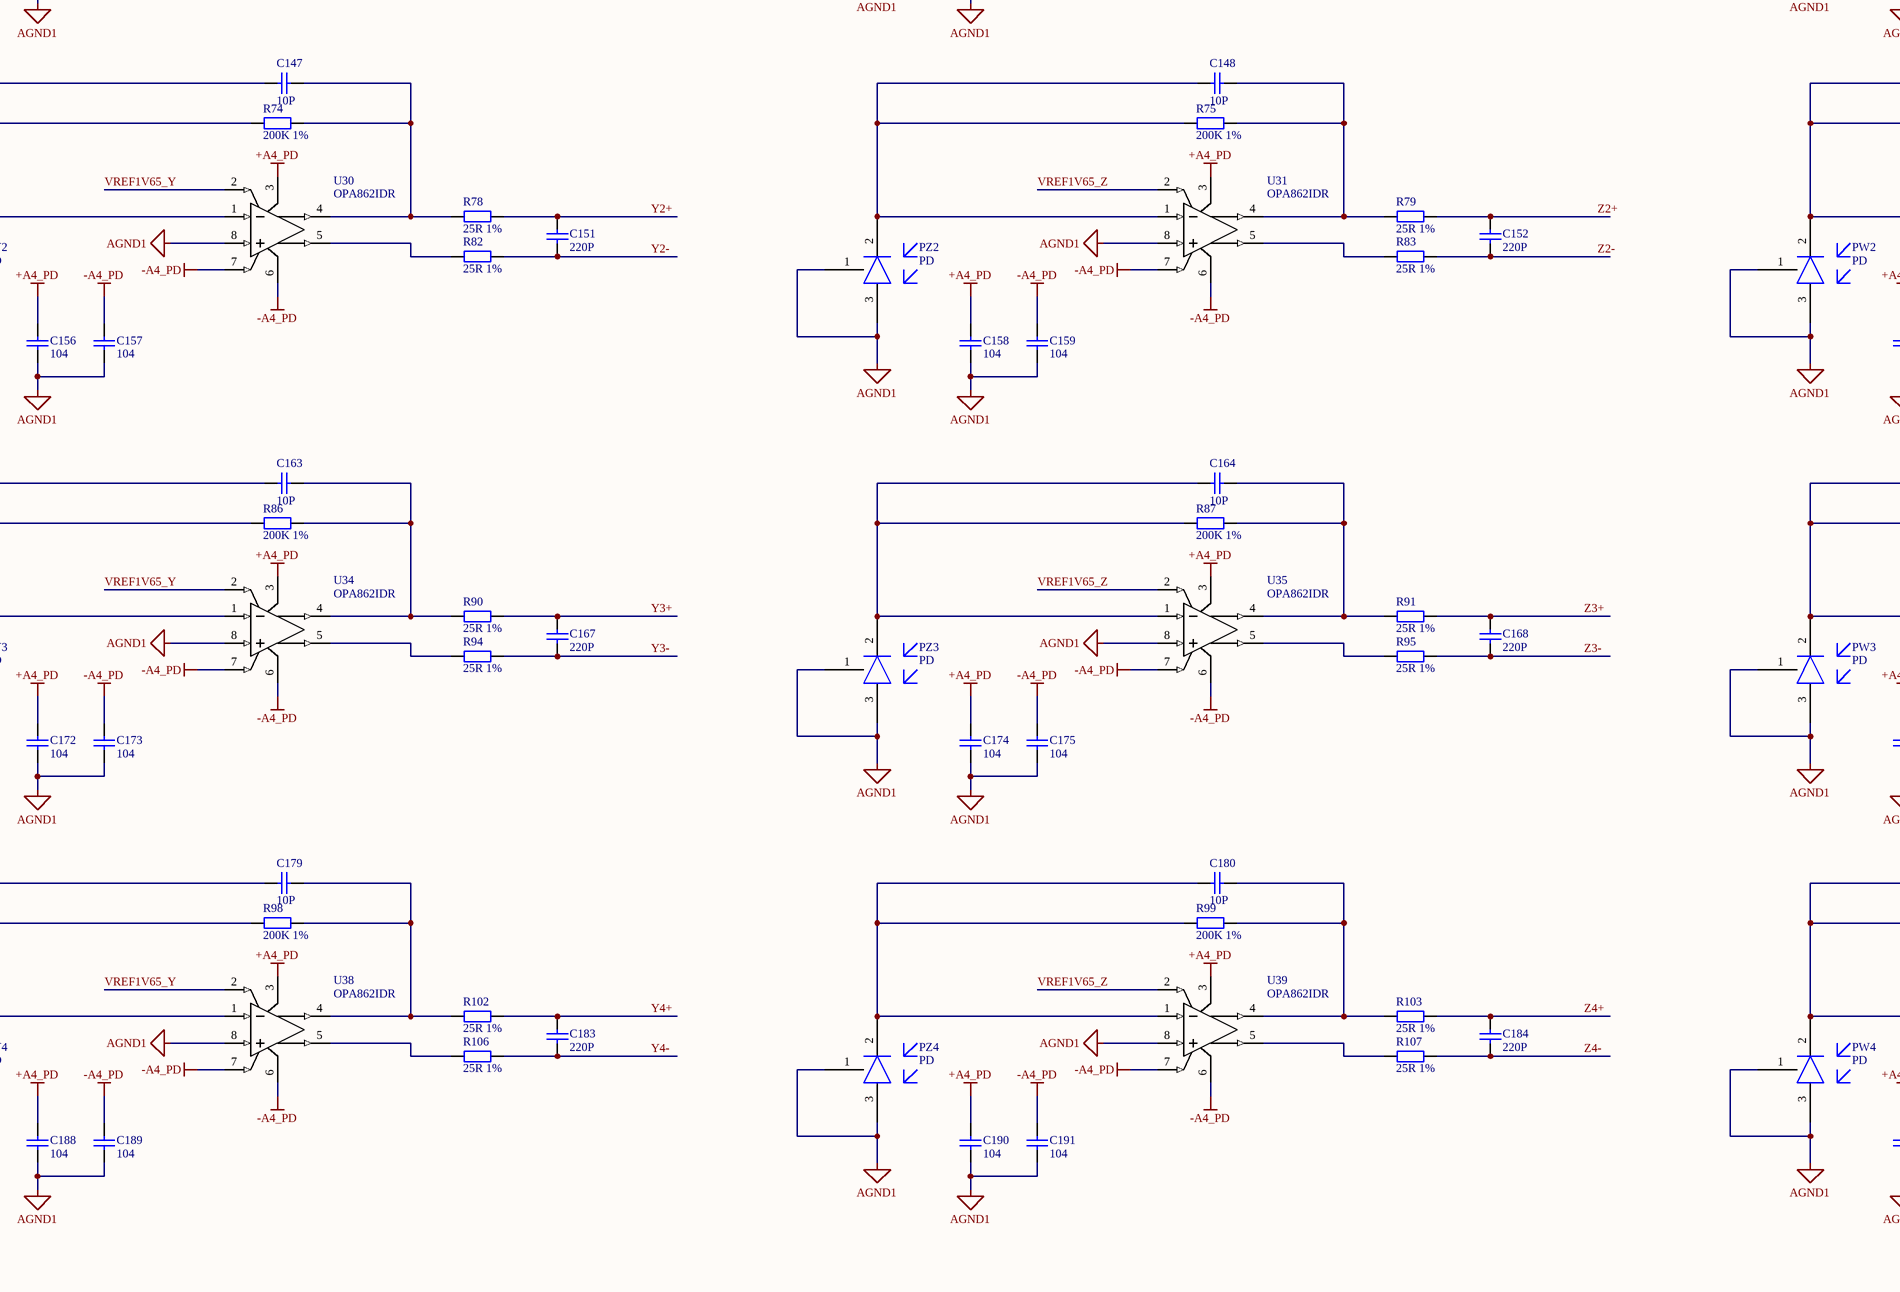
[diagram p7: PD.SchDoc, bottom middle]
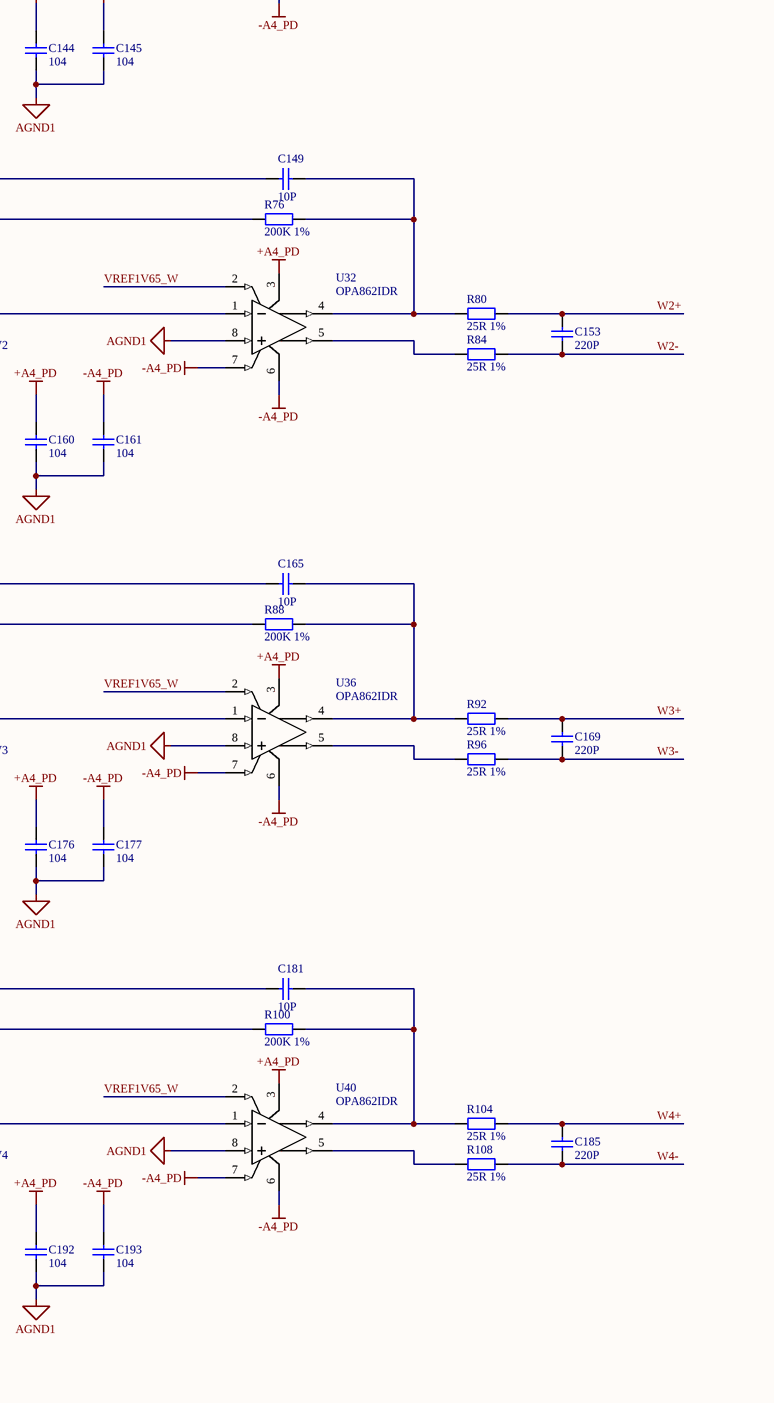
[diagram p8: PD.SchDoc, bottom right]

### Parts
C52  10u  [C0805_L]
C53  10u  [C0805_L]
C54  10u  [C0805_L]
C55  10u  [C0805_L]
C56  1u  [C0805_L]
C57  10u  [C0805_L]
C58  1u  [C0402_L]
C59  1u  [C0402_L]
C60  10u  [C0805_L]
C61  10u  [C0805_L]
C62  10u  [C0805_L]
C63  10u  [C0805_L]
C64  1u  [C0805_L]
C65  104  [C0402_L]
C66  104  [C0402_L]
C67  104  [C0402_L]
C68  104  [C0402_L]
C69  104  [C0402_L]
C70  104  [C0402_L]
C71  10u  [C0402_L]
C72  10u  [C0402_L]
C73  10u  [C0402_L]
C74  10u  [C0402_L]
C75  104  [C0402_L]
C76  104  [C0402_L]
C77  104  [C0402_L]
C78  104  [C0402_L]
C79  104  [C0402_L]
C80  104  [C0402_L]
C81  10u  [C0402_L]
C82  10u  [C0402_L]
C83  10u  [C0402_L]
C84  10u  [C0402_L]
C85  104  [C0402_L]
C86  104  [C0402_L]
C87  104  [C0402_L]
C88  104  [C0402_L]
C89  10u  [C0805_L]
C90  10u  [C0805_L]
C91  10u  [C0805_L]
C92  10u  [C0805_L]
C93  1u  [C0805_L]
C94  104  [C0402_L]
C95  104  [C0402_L]
C96  104  [C0402_L]
C97  104  [C0402_L]
C98  104  [C0402_L]
C99  104  [C0402_L]
C100  10u  [C0402_L]
C101  10u  [C0402_L]
C102  10u  [C0402_L]
C103  10u  [C0402_L]
C104  104  [C0402_L]
C105  104  [C0402_L]
C106  104  [C0402_L]
C107  104  [C0402_L]
C108  104  [C0402_L]
C109  104  [C0402_L]
C110  10u  [C0402_L]
C111  10u  [C0402_L]
C112  10u  [C0402_L]
C113  10u  [C0402_L]
C114  104  [C0402_L]
C115  104  [C0402_L]
C116  104  [C0402_L]
C117  104  [C0402_L]
C118  104  [C0402_L]
C119  104  [C0402_L]
C120  104  [C0402_L]
C121  104  [C0402_L]
C122  104  [C0402_L]
C123  10u  [C0805_L]
C124  10u  [C0805_L]
C125  104  [C0402_L]
C126  104  [C0402_L]
C127  10u  [C0805_L]
C128  10u  [C0805_L]
C129  1u  [C0805_L]
C130  10P  [C0402_L]
C131  10P  [C0402_L]
C132  10P  [C0402_L]
C133  10P  [C0402_L]
C134  220P  [C0402_L]
C135  220P  [C0402_L]
C136  220P  [C0402_L]
C137  220P  [C0402_L]
C138  104  [C0402_L]
C139  104  [C0402_L]
C140  104  [C0402_L]
C141  104  [C0402_L]
C142  104  [C0402_L]
C143  104  [C0402_L]
C144  104  [C0402_L]
C145  104  [C0402_L]
C146  10P  [C0402_L]
C147  10P  [C0402_L]
C148  10P  [C0402_L]
C149  10P  [C0402_L]
C150  220P  [C0402_L]
C151  220P  [C0402_L]
C152  220P  [C0402_L]
C153  220P  [C0402_L]
C154  104  [C0402_L]
C155  104  [C0402_L]
C156  104  [C0402_L]
C157  104  [C0402_L]
C158  104  [C0402_L]
C159  104  [C0402_L]
C160  104  [C0402_L]
C161  104  [C0402_L]
C162  10P  [C0402_L]
C163  10P  [C0402_L]
C164  10P  [C0402_L]
C165  10P  [C0402_L]
C166  220P  [C0402_L]
C167  220P  [C0402_L]
C168  220P  [C0402_L]
C169  220P  [C0402_L]
C170  104  [C0402_L]
C171  104  [C0402_L]
C172  104  [C0402_L]
C173  104  [C0402_L]
C174  104  [C0402_L]
C175  104  [C0402_L]
C176  104  [C0402_L]
C177  104  [C0402_L]
C178  10P  [C0402_L]
C179  10P  [C0402_L]
C180  10P  [C0402_L]
C181  10P  [C0402_L]
C182  220P  [C0402_L]
C183  220P  [C0402_L]
C184  220P  [C0402_L]
C185  220P  [C0402_L]
C186  104  [C0402_L]
C187  104  [C0402_L]
C188  104  [C0402_L]
C189  104  [C0402_L]
C190  104  [C0402_L]
C191  104  [C0402_L]
C192  104  [C0402_L]
C193  104  [C0402_L]
C194  10P  [C0402_L]
C195  220P  [C0402_L]
C196  104  [C0402_L]
C197  104  [C0402_L]
P9  PD  [PD]
PW1  PD  [PD]
PW2  PD  [PD]
PW3  PD  [PD]
PW4  PD  [PD]
PX1  PD  [PD]
PX2  PD  [PD]
PX3  PD  [PD]
PX4  PD  [PD]
PY1  PD  [PD]
PY2  PD  [PD]
PY3  PD  [PD]
PY4  PD  [PD]
PZ1  PD  [PD]
PZ2  PD  [PD]
PZ3  PD  [PD]
PZ4  PD  [PD]
R51  33R  [RCA-8P4R-0402]
R52  33R  [RCA-8P4R-0402]
R53  33R  [RCA-8P4R-0402]
R54  33R  [RCA-8P4R-0402]
R55  33R  [RCA-8P4R-0402]
R56  33R  [RCA-8P4R-0402]
R57  33R  [RCA-8P4R-0402]
R58  0R  [R0402_L]
R59  33R  [RCA-8P4R-0402]
R60  33R  [RCA-8P4R-0402]
R61  200K 1%  [R0402_L]
R62  200K 1%  [R0402_L]
R63  200K 1%  [R0402_L]
R64  200K 1%  [R0402_L]
R65  25R 1%  [R0402_L]
R66  25R 1%  [R0402_L]
R67  25R 1%  [R0402_L]
R68  25R 1%  [R0402_L]
R69  25R 1%  [R0402_L]
R70  25R 1%  [R0402_L]
R71  25R 1%  [R0402_L]
R72  25R 1%  [R0402_L]
R73  200K 1%  [R0402_L]
R74  200K 1%  [R0402_L]
R75  200K 1%  [R0402_L]
R76  200K 1%  [R0402_L]
R77  25R 1%  [R0402_L]
R78  25R 1%  [R0402_L]
R79  25R 1%  [R0402_L]
R80  25R 1%  [R0402_L]
R81  25R 1%  [R0402_L]
R82  25R 1%  [R0402_L]
R83  25R 1%  [R0402_L]
R84  25R 1%  [R0402_L]
R85  200K 1%  [R0402_L]
R86  200K 1%  [R0402_L]
R87  200K 1%  [R0402_L]
R88  200K 1%  [R0402_L]
R89  25R 1%  [R0402_L]
R90  25R 1%  [R0402_L]
R91  25R 1%  [R0402_L]
R92  25R 1%  [R0402_L]
R93  25R 1%  [R0402_L]
R94  25R 1%  [R0402_L]
R95  25R 1%  [R0402_L]
R96  25R 1%  [R0402_L]
R97  200K 1%  [R0402_L]
R98  200K 1%  [R0402_L]
R99  200K 1%  [R0402_L]
R100  200K 1%  [R0402_L]
R101  25R 1%  [R0402_L]
R102  25R 1%  [R0402_L]
R103  25R 1%  [R0402_L]
R104  25R 1%  [R0402_L]
R105  25R 1%  [R0402_L]
R106  25R 1%  [R0402_L]
R107  25R 1%  [R0402_L]
R108  25R 1%  [R0402_L]
R109  200K 1%  [R0402_L]
R110  25R 1%  [R0402_L]
R111  25R 1%  [R0402_L]
U15  LTC2325HUKG-16PBF  [UKG_52A_ADI]  (parts A,B of 2)
U16  LTC2325HUKG-16PBF  [UKG_52A_ADI]  (parts A,B of 2)
U17  LTC2325HUKG-16PBF  [UKG_52A_ADI]  (parts A,B of 2)
U18  LTC2325HUKG-16PBF  [UKG_52A_ADI]  (parts A,B of 2)
U19  LTC2311HMSE-16PBF  [MSE_16_ADI]
U20  REF1933AIDDCT  [DDC5_TEX]
U21  REF1933AIDDCT  [DDC5_TEX]
U22  REF1933AIDDCT  [DDC5_TEX]
U23  REF1933AIDDCT  [DDC5_TEX]
U24  REF1933AIDDCT  [DDC5_TEX]
U25  OPA862IDR  [SOIC-8]
U26  OPA862IDR  [SOIC-8]
U27  OPA862IDR  [SOIC-8]
U28  OPA862IDR  [SOIC-8]
U29  OPA862IDR  [SOIC-8]
U30  OPA862IDR  [SOIC-8]
U31  OPA862IDR  [SOIC-8]
U32  OPA862IDR  [SOIC-8]
U33  OPA862IDR  [SOIC-8]
U34  OPA862IDR  [SOIC-8]
U35  OPA862IDR  [SOIC-8]
U36  OPA862IDR  [SOIC-8]
U37  OPA862IDR  [SOIC-8]
U38  OPA862IDR  [SOIC-8]
U39  OPA862IDR  [SOIC-8]
U40  OPA862IDR  [SOIC-8]
U41  OPA862IDR  [SOIC-8]

### Nets
+A3V3_PD: C58.1 C67.1 C68.1 C69.1 C70.1 C71.1 C72.1 C73.1 C74.1 C77.1 C78.1 C79.1 C80.1 C81.1 C82.1 C83.1 C84.1 C96.1 C97.1 C98.1 C99.1 C100.1 C101.1 C102.1 C103.1 C106.1 C107.1 C108.1 C109.1 C110.1 C111.1 C112.1 C113.1 U15.15(VDD) U15.21(VDD) U15.43(REFBUFEN) U15.44(VDD) U15.52(VDD) U16.15(VDD) U16.21(VDD) U16.43(REFBUFEN) U16.44(VDD) U16.52(VDD) U17.15(VDD) U17.21(VDD) U17.43(REFBUFEN) U17.44(VDD) U17.52(VDD) U18.15(VDD) U18.21(VDD) U18.43(REFBUFEN) U18.44(VDD) U18.52(VDD) U19.4(VDD)
+A4_PD: C138.1 C140.1 C142.1 C144.1 C154.1 C156.1 C158.1 C160.1 C170.1 C172.1 C174.1 C176.1 C186.1 C188.1 C190.1 C192.1 C196.1 U25.3(VS+) U26.3(VS+) U27.3(VS+) U28.3(VS+) U29.3(VS+) U30.3(VS+) U31.3(VS+) U32.3(VS+) U33.3(VS+) U34.3(VS+) U35.3(VS+) U36.3(VS+) U37.3(VS+) U38.3(VS+) U39.3(VS+) U40.3(VS+) U41.3(VS+)
+A5_PD: C65.2 C66.2 C87.2 C88.2 C120.2 U20.3(EN) U20.4(VIN) U21.3(EN) U21.4(VIN) U22.3(EN) U22.4(VIN) U23.3(EN) U23.4(VIN) U24.3(EN) U24.4(VIN)
+D2V5_PD: C59.1 C75.1 C76.1 C85.1 C86.1 C104.1 C105.1 C114.1 C115.1 U15.31(OVDD) U15.34(*CLKOUTEN/CLKOUT-) U15.37(OVDD) U16.31(OVDD) U16.34(*CLKOUTEN/CLKOUT-) U16.37(OVDD) U17.31(OVDD) U17.34(*CLKOUTEN/CLKOUT-) U17.37(OVDD) U18.31(OVDD) U18.34(*CLKOUTEN/CLKOUT-) U18.37(OVDD) U19.12(OVDD)
-A4_PD: C139.1 C141.1 C143.1 C145.1 C155.1 C157.1 C159.1 C161.1 C171.1 C173.1 C175.1 C177.1 C187.1 C189.1 C191.1 C193.1 C197.1 U25.6(VS-) U25.7(PD_N) U26.6(VS-) U26.7(PD_N) U27.6(VS-) U27.7(PD_N) U28.6(VS-) U28.7(PD_N) U29.6(VS-) U29.7(PD_N) U30.6(VS-) U30.7(PD_N) U31.6(VS-) U31.7(PD_N) U32.6(VS-) U32.7(PD_N) U33.6(VS-) U33.7(PD_N) U34.6(VS-) U34.7(PD_N) U35.6(VS-) U35.7(PD_N) U36.6(VS-) U36.7(PD_N) U37.6(VS-) U37.7(PD_N) U38.6(VS-) U38.7(PD_N) U39.6(VS-) U39.7(PD_N) U40.6(VS-) U40.7(PD_N) U41.6(VS-) U41.7(PD_N)
AGND1: C52.2 C53.2 C54.2 C55.2 C56.1 C57.2 C58.2 C59.2 C60.2 C61.2 C62.2 C63.2 C64.1 C65.1 C66.1 C67.2 C68.2 C69.2 C70.2 C71.2 C72.2 C73.2 C74.2 C75.2 C76.2 C77.2 C78.2 C79.2 C80.2 C81.2 C82.2 C83.2 C84.2 C85.2 C86.2 C87.1 C88.1 C89.2 C90.2 C91.2 C92.2 C93.1 C94.1 C95.1 C96.2 C97.2 C98.2 C99.2 C100.2 C101.2 C102.2 C103.2 C104.2 C105.2 C106.2 C107.2 C108.2 C109.2 C110.2 C111.2 C112.2 C113.2 C114.2 C115.2 C116.1 C117.1 C118.1 C119.1 C120.1 C121.1 C122.1 C123.2 C124.2 C125.1 C126.1 C127.2 C128.2 C129.1 C138.2 C139.2 C140.2 C141.2 C142.2 C143.2 C144.2 C145.2 C154.2 C155.2 C156.2 C157.2 C158.2 C159.2 C160.2 C161.2 C170.2 C171.2 C172.2 C173.2 C174.2 C175.2 C176.2 C177.2 C186.2 C187.2 C188.2 C189.2 C190.2 C191.2 C192.2 C193.2 C196.2 C197.2 P9.1 P9.3 PW1.1 PW1.3 PW2.1 PW2.3 PW3.1 PW3.3 PW4.1 PW4.3 PX1.1 PX1.3 PX2.1 PX2.3 PX3.1 PX3.3 PX4.1 PX4.3 PY1.1 PY1.3 PY2.1 PY2.3 PY3.1 PY3.3 PY4.1 PY4.3 PZ1.1 PZ1.3 PZ2.1 PZ2.3 PZ3.1 PZ3.3 PZ4.1 PZ4.3 R58.1 U15.3(GND) U15.7(GND) U15.12(GND) U15.18(GND) U15.23(*SDR/DDR) U15.25(*CMOS/LVDS) U15.26(GND) U15.32(GND) U15.38(GND) U15.46(GND) U15.49(GND) U15.53(GND) U16.3(GND) U16.7(GND) U16.12(GND) U16.18(GND) U16.23(*SDR/DDR) U16.25(*CMOS/LVDS) U16.26(GND) U16.32(GND) U16.38(GND) U16.46(GND) U16.49(GND) U16.53(GND) U17.3(GND) U17.7(GND) U17.12(GND) U17.18(GND) U17.23(*SDR/DDR) U17.25(*CMOS/LVDS) U17.26(GND) U17.32(GND) U17.38(GND) U17.46(GND) U17.49(GND) U17.53(GND) U18.3(GND) U18.7(GND) U18.12(GND) U18.18(GND) U18.23(*SDR/DDR) U18.25(*CMOS/LVDS) U18.26(GND) U18.32(GND) U18.38(GND) U18.46(GND) U18.49(GND) U18.53(GND) U19.1(GND) U19.2(REFIN) U19.5(GND) U19.8(GND) U19.10(*CMOS/LVDS) U19.11(GND) U19.17(GND) U20.2(GND) U21.2(GND) U22.2(GND) U23.2(GND) U24.2(GND) U25.8(VIN+) U26.8(VIN+) U27.8(VIN+) U28.8(VIN+) U29.8(VIN+) U30.8(VIN+) U31.8(VIN+) U32.8(VIN+) U33.8(VIN+) U34.8(VIN+) U35.8(VIN+) U36.8(VIN+) U37.8(VIN+) U38.8(VIN+) U39.8(VIN+) U40.8(VIN+) U41.8(VIN+)
GND: R58.2
9+: C195.2 R110.2 U19.6(AIN+)
9-: C195.1 R111.2 U19.7(AIN-)
CNV: R53.3 U19.9(*CNV)
CNV9: R53.6
SCK: R53.1 U19.16(SCK+)
SCK9: R53.8
SDO9: R53.7
VREF1V65_9: C126.2 U24.1(VBIAS) U41.2(VOCM)
VREF1V65_W: C122.2 U22.1(VBIAS) U28.2(VOCM) U32.2(VOCM) U36.2(VOCM) U40.2(VOCM)
VREF1V65_X: C95.2 U20.1(VBIAS) U25.2(VOCM) U29.2(VOCM) U33.2(VOCM) U37.2(VOCM)
VREF1V65_Y: C117.2 U21.1(VBIAS) U26.2(VOCM) U30.2(VOCM) U34.2(VOCM) U38.2(VOCM)
VREF1V65_Z: C119.2 U23.1(VBIAS) U27.2(VOCM) U31.2(VOCM) U35.2(VOCM) U39.2(VOCM)
VREF3V3_9: C57.1 C125.2 U19.3(REFOUT) U24.5(VREF)
VREF3V3_W: C121.2 C129.2 U18.8(REF) U22.5(VREF)
VREF3V3_X: C56.2 C94.2 U15.8(REF) U20.5(VREF)
VREF3V3_Y: C64.2 C116.2 U16.8(REF) U21.5(VREF)
VREF3V3_Z: C93.2 C118.2 U17.8(REF) U23.5(VREF)
W1+: C137.2 R68.2 U18.14(AIN1+)
W1-: C137.1 R72.2 U18.13(AIN1-)
W2+: C153.2 R80.2 U18.11(AIN2+)
W2-: C153.1 R84.2 U18.10(AIN2-)
W3+: C169.2 R92.2 U18.5(AIN3+)
W3-: C169.1 R96.2 U18.4(AIN3-)
W4+: C185.2 R104.2 U18.2(AIN4+)
W4-: C185.1 R108.2 U18.1(AIN4-)
W_CLKOUT: R59.5
W_CNV: R60.6
W_SCK: R59.8
W_SDO1: R60.7
W_SDO2: R60.8
W_SDO3: R59.6
W_SDO4: R59.7
X1+: C134.2 R65.2 U15.14(AIN1+)
X1-: C134.1 R69.2 U15.13(AIN1-)
X2+: C150.2 R77.2 U15.11(AIN2+)
X2-: C150.1 R81.2 U15.10(AIN2-)
X3+: C166.2 R89.2 U15.5(AIN3+)
X3-: C166.1 R93.2 U15.4(AIN3-)
X4+: C182.2 R101.2 U15.2(AIN4+)
X4-: C182.1 R105.2 U15.1(AIN4-)
X_CLKOUT: R51.5
X_CNV: R52.6
X_SCK: R51.8
X_SDO1: R52.7
X_SDO2: R52.8
X_SDO3: R51.6
X_SDO4: R51.7
Y1+: C135.2 R66.2 U16.14(AIN1+)
Y1-: C135.1 R70.2 U16.13(AIN1-)
Y2+: C151.2 R78.2 U16.11(AIN2+)
Y2-: C151.1 R82.2 U16.10(AIN2-)
Y3+: C167.2 R90.2 U16.5(AIN3+)
Y3-: C167.1 R94.2 U16.4(AIN3-)
Y4+: C183.2 R102.2 U16.2(AIN4+)
Y4-: C183.1 R106.2 U16.1(AIN4-)
Y_CLKOUT: R54.5
Y_CNV: R55.6
Y_SCK: R54.8
Y_SDO1: R55.7
Y_SDO2: R55.8
Y_SDO3: R54.6
Y_SDO4: R54.7
Z1+: C136.2 R67.2 U17.14(AIN1+)
Z1-: C136.1 R71.2 U17.13(AIN1-)
Z2+: C152.2 R79.2 U17.11(AIN2+)
Z2-: C152.1 R83.2 U17.10(AIN2-)
Z3+: C168.2 R91.2 U17.5(AIN3+)
Z3-: C168.1 R95.2 U17.4(AIN3-)
Z4+: C184.2 R103.2 U17.2(AIN4+)
Z4-: C184.1 R107.2 U17.1(AIN4-)
Z_CLKOUT: R56.5
Z_CNV: R57.6
Z_SCK: R56.8
Z_SDO1: R57.7
Z_SDO2: R57.8
Z_SDO3: R56.6
Z_SDO4: R56.7
NetC52_1: C52.1 U15.22(REFOUT1)
NetC53_1: C53.1 U15.9(REFOUT2)
NetC54_1: C54.1 U15.6(REFOUT3)
NetC55_1: C55.1 U15.45(REFOUT4)
NetC60_1: C60.1 U16.22(REFOUT1)
NetC61_1: C61.1 U16.9(REFOUT2)
NetC62_1: C62.1 U16.6(REFOUT3)
NetC63_1: C63.1 U16.45(REFOUT4)
NetC89_1: C89.1 U17.22(REFOUT1)
NetC90_1: C90.1 U17.9(REFOUT2)
NetC91_1: C91.1 U17.6(REFOUT3)
NetC92_1: C92.1 U17.45(REFOUT4)
NetC123_1: C123.1 U18.22(REFOUT1)
NetC124_1: C124.1 U18.9(REFOUT2)
NetC127_1: C127.1 U18.6(REFOUT3)
NetC128_1: C128.1 U18.45(REFOUT4)
NetC130_1: C130.1 PX1.2 R61.1 U25.1(VIN-)
NetC130_2: C130.2 R61.2 R65.1 U25.4(VOUT+)
NetC131_1: C131.1 PY1.2 R62.1 U26.1(VIN-)
NetC131_2: C131.2 R62.2 R66.1 U26.4(VOUT+)
NetC132_1: C132.1 PZ1.2 R63.1 U27.1(VIN-)
NetC132_2: C132.2 R63.2 R67.1 U27.4(VOUT+)
NetC133_1: C133.1 PW1.2 R64.1 U28.1(VIN-)
NetC133_2: C133.2 R64.2 R68.1 U28.4(VOUT+)
NetC146_1: C146.1 PX2.2 R73.1 U29.1(VIN-)
NetC146_2: C146.2 R73.2 R77.1 U29.4(VOUT+)
NetC147_1: C147.1 PY2.2 R74.1 U30.1(VIN-)
NetC147_2: C147.2 R74.2 R78.1 U30.4(VOUT+)
NetC148_1: C148.1 PZ2.2 R75.1 U31.1(VIN-)
NetC148_2: C148.2 R75.2 R79.1 U31.4(VOUT+)
NetC149_1: C149.1 PW2.2 R76.1 U32.1(VIN-)
NetC149_2: C149.2 R76.2 R80.1 U32.4(VOUT+)
NetC162_1: C162.1 PX3.2 R85.1 U33.1(VIN-)
NetC162_2: C162.2 R85.2 R89.1 U33.4(VOUT+)
NetC163_1: C163.1 PY3.2 R86.1 U34.1(VIN-)
NetC163_2: C163.2 R86.2 R90.1 U34.4(VOUT+)
NetC164_1: C164.1 PZ3.2 R87.1 U35.1(VIN-)
NetC164_2: C164.2 R87.2 R91.1 U35.4(VOUT+)
NetC165_1: C165.1 PW3.2 R88.1 U36.1(VIN-)
NetC165_2: C165.2 R88.2 R92.1 U36.4(VOUT+)
NetC178_1: C178.1 PX4.2 R97.1 U37.1(VIN-)
NetC178_2: C178.2 R97.2 R101.1 U37.4(VOUT+)
NetC179_1: C179.1 PY4.2 R98.1 U38.1(VIN-)
NetC179_2: C179.2 R98.2 R102.1 U38.4(VOUT+)
NetC180_1: C180.1 PZ4.2 R99.1 U39.1(VIN-)
NetC180_2: C180.2 R99.2 R103.1 U39.4(VOUT+)
NetC181_1: C181.1 PW4.2 R100.1 U40.1(VIN-)
NetC181_2: C181.2 R100.2 R104.1 U40.4(VOUT+)
NetC194_1: C194.1 P9.2 R109.1 U41.1(VIN-)
NetC194_2: C194.2 R109.2 R110.1 U41.4(VOUT+)
NetR51_1: R51.1 U15.41(SCK/SCK+)
NetR51_2: R51.2 U15.39(SDO4/SDOD+)
NetR51_3: R51.3 U15.35(SDO3/SDOC+)
NetR51_4: R51.4 U15.33(CLKOUT/CLKOUT+)
NetR52_1: R52.1 U15.29(SDO2/SDOB+)
NetR52_2: R52.2 U15.27(SDO1/SDOA+)
NetR52_3: R52.3 U15.24(*CNV)
NetR53_2: R53.2 U19.14(SDO+)
NetR54_1: R54.1 U16.41(SCK/SCK+)
NetR54_2: R54.2 U16.39(SDO4/SDOD+)
NetR54_3: R54.3 U16.35(SDO3/SDOC+)
NetR54_4: R54.4 U16.33(CLKOUT/CLKOUT+)
NetR55_1: R55.1 U16.29(SDO2/SDOB+)
NetR55_2: R55.2 U16.27(SDO1/SDOA+)
NetR55_3: R55.3 U16.24(*CNV)
NetR56_1: R56.1 U17.41(SCK/SCK+)
NetR56_2: R56.2 U17.39(SDO4/SDOD+)
NetR56_3: R56.3 U17.35(SDO3/SDOC+)
NetR56_4: R56.4 U17.33(CLKOUT/CLKOUT+)
NetR57_1: R57.1 U17.29(SDO2/SDOB+)
NetR57_2: R57.2 U17.27(SDO1/SDOA+)
NetR57_3: R57.3 U17.24(*CNV)
NetR59_1: R59.1 U18.41(SCK/SCK+)
NetR59_2: R59.2 U18.39(SDO4/SDOD+)
NetR59_3: R59.3 U18.35(SDO3/SDOC+)
NetR59_4: R59.4 U18.33(CLKOUT/CLKOUT+)
NetR60_1: R60.1 U18.29(SDO2/SDOB+)
NetR60_2: R60.2 U18.27(SDO1/SDOA+)
NetR60_3: R60.3 U18.24(*CNV)
NetR69_1: R69.1 U25.5(VOUT-)
NetR70_1: R70.1 U26.5(VOUT-)
NetR71_1: R71.1 U27.5(VOUT-)
NetR72_1: R72.1 U28.5(VOUT-)
NetR81_1: R81.1 U29.5(VOUT-)
NetR82_1: R82.1 U30.5(VOUT-)
NetR83_1: R83.1 U31.5(VOUT-)
NetR84_1: R84.1 U32.5(VOUT-)
NetR93_1: R93.1 U33.5(VOUT-)
NetR94_1: R94.1 U34.5(VOUT-)
NetR95_1: R95.1 U35.5(VOUT-)
NetR96_1: R96.1 U36.5(VOUT-)
NetR105_1: R105.1 U37.5(VOUT-)
NetR106_1: R106.1 U38.5(VOUT-)
NetR107_1: R107.1 U39.5(VOUT-)
NetR108_1: R108.1 U40.5(VOUT-)
NetR111_1: R111.1 U41.5(VOUT-)

Not connected (* = marked no-connect by the designer): R52 4* 5*; R53 4* 5*; R55 4* 5*; R57 4* 5*; R60 4* 5*; U15 16(NC)* 17(NC)* 19(NC)* 20(NC)* 28(DNC/SDOA-)* 30(DNC/SDOB-)* 36(DNC/SDOC-)* 40(DNC/SDOD-)* 42(DNC/SCK-)* 47(NC)* 48(NC)* 50(NC)* 51(NC)*; U16 16(NC)* 17(NC)* 19(NC)* 20(NC)* 28(DNC/SDOA-)* 30(DNC/SDOB-)* 36(DNC/SDOC-)* 40(DNC/SDOD-)* 42(DNC/SCK-)* 47(NC)* 48(NC)* 50(NC)* 51(NC)*; U17 16(NC)* 17(NC)* 19(NC)* 20(NC)* 28(DNC/SDOA-)* 30(DNC/SDOB-)* 36(DNC/SDOC-)* 40(DNC/SDOD-)* 42(DNC/SCK-)* 47(NC)* 48(NC)* 50(NC)* 51(NC)*; U18 16(NC)* 17(NC)* 19(NC)* 20(NC)* 28(DNC/SDOA-)* 30(DNC/SDOB-)* 36(DNC/SDOC-)* 40(DNC/SDOD-)* 42(DNC/SCK-)* 47(NC)* 48(NC)* 50(NC)* 51(NC)*; U19 13(SDO-)* 15(SCK-)*

### Notes on the sheet
- (in symbol LTC2325HUKG-16PBF, part A) 1 of 2
- (in symbol LTC2325HUKG-16PBF, part B) 2 of 2

### Library data of the parts
C52-C197 = C: as C1 on sheet S7500_Drv
R51-R57 R59 R60 = R-8P4R: as R11 on sheet S7500_Drv
R58 R61-R111 = R: 贴片电阻; 联系下单店铺卖家 免费帮你查找封装: 联系下单店铺卖家 免费技术支持; BOM名称: 贴片电阻
U15-U18 = LTC2325HUKG-16PBF: No Description Available; Mfr_Name: Analog Devices Inc; RefDes: RefDes; Type: Type
U19 = LTC2311HMSE-16PBF: No Description Available; Mfr_Name: Analog Devices Inc; RefDes: RefDes; Type: Type
U20-U24 = REF1925AIDDCT: No Description Available; Mfr_Name: Texas Instruments; RefDes: RefDes; Type: Type
U25-U41 = OPA862IDR: No Description Available; Mfr_Name: Texas Instruments; TYPE: TYPE; RefDes: RefDes

## Sheet PWR.SchDoc
size A2; SheetNumber: 4; SheetTotal: 6
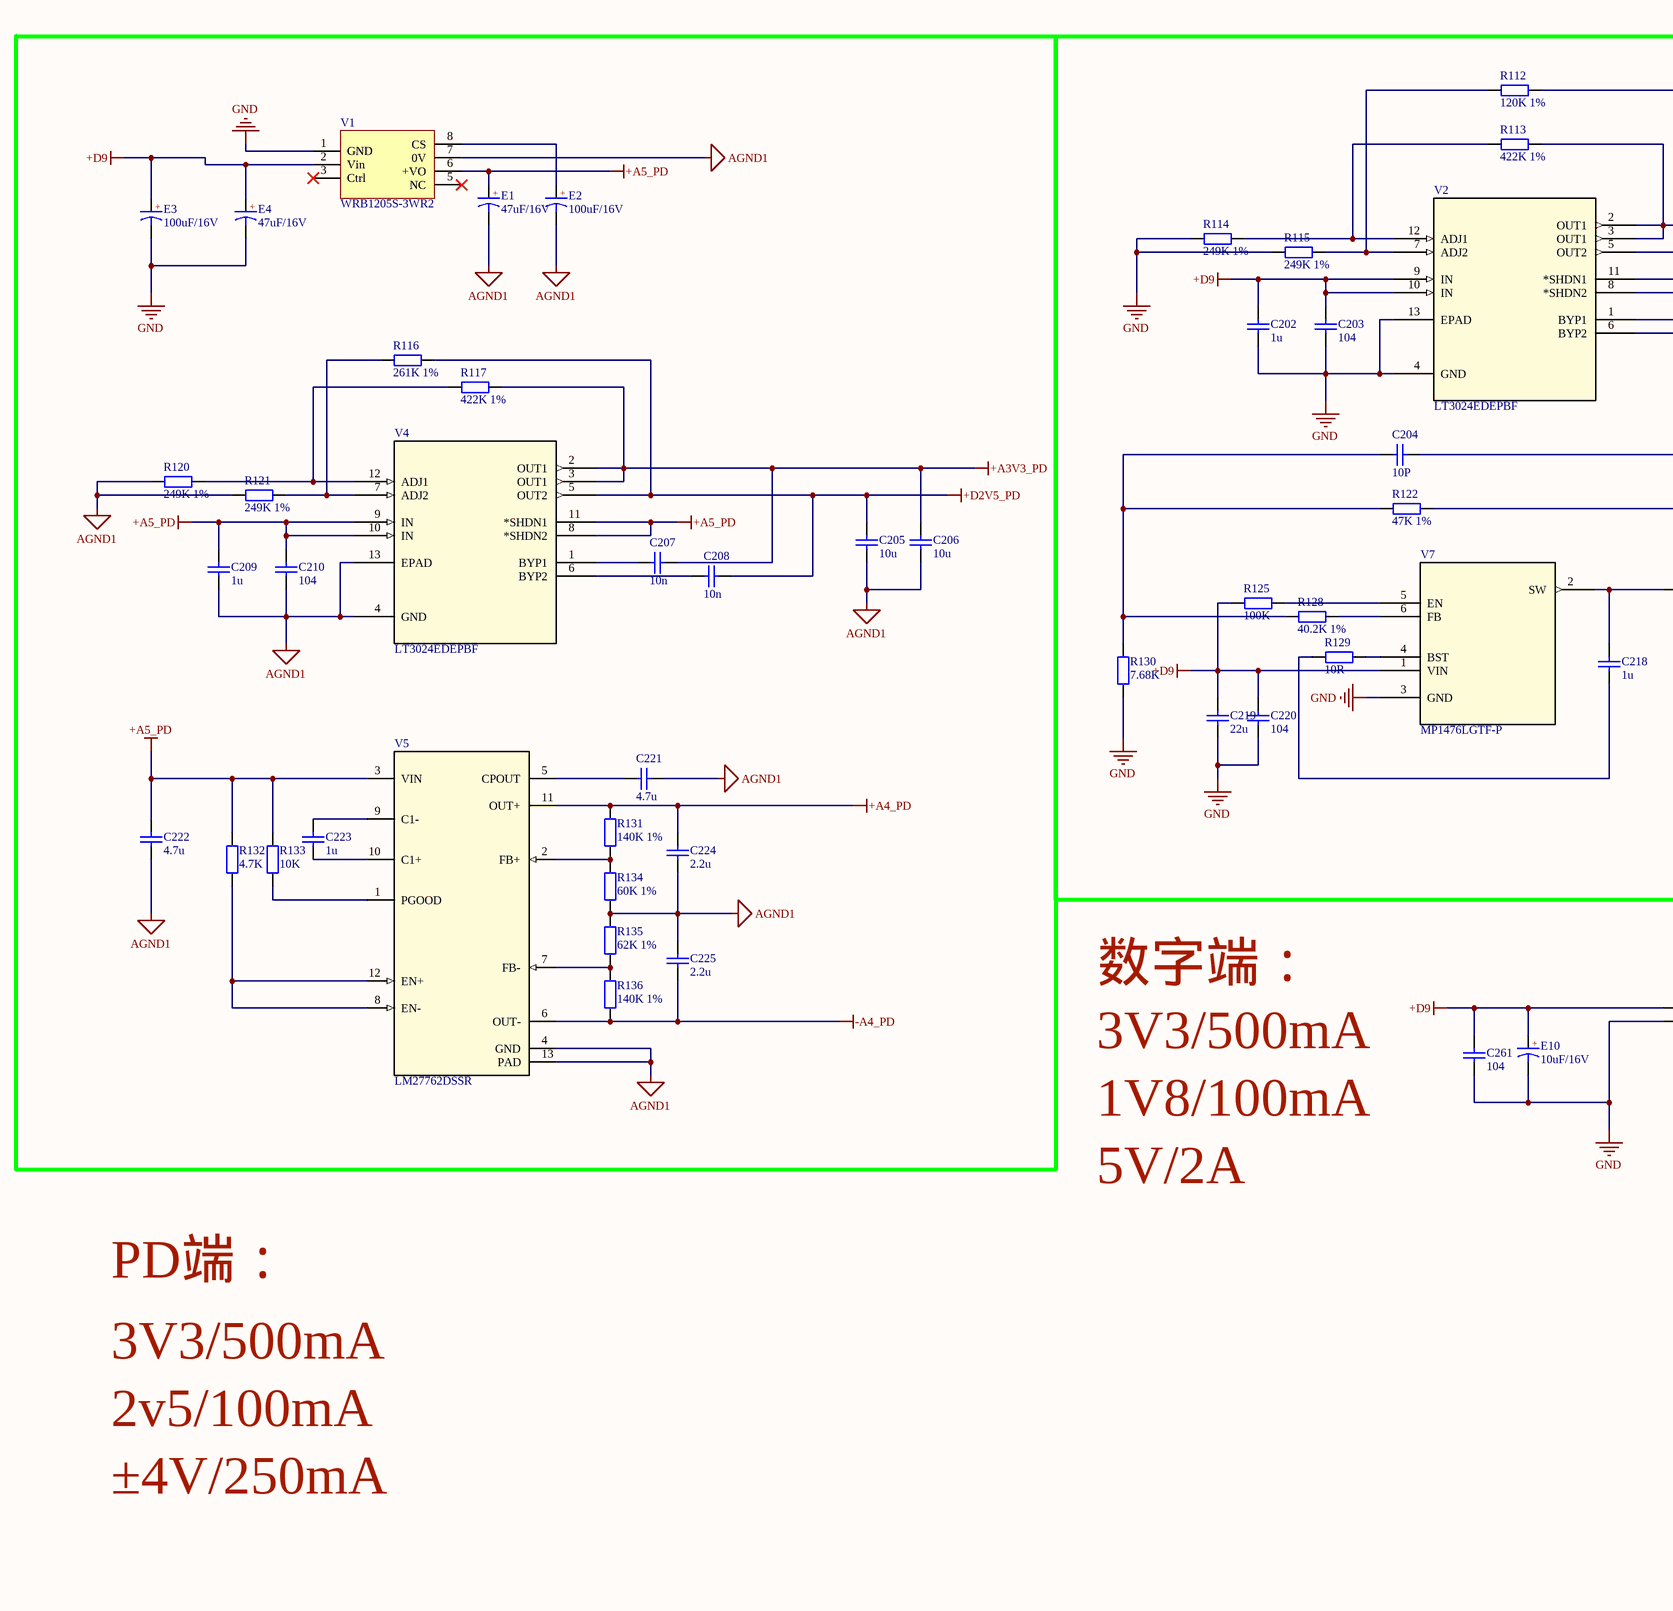
[diagram p9: PWR.SchDoc, left]
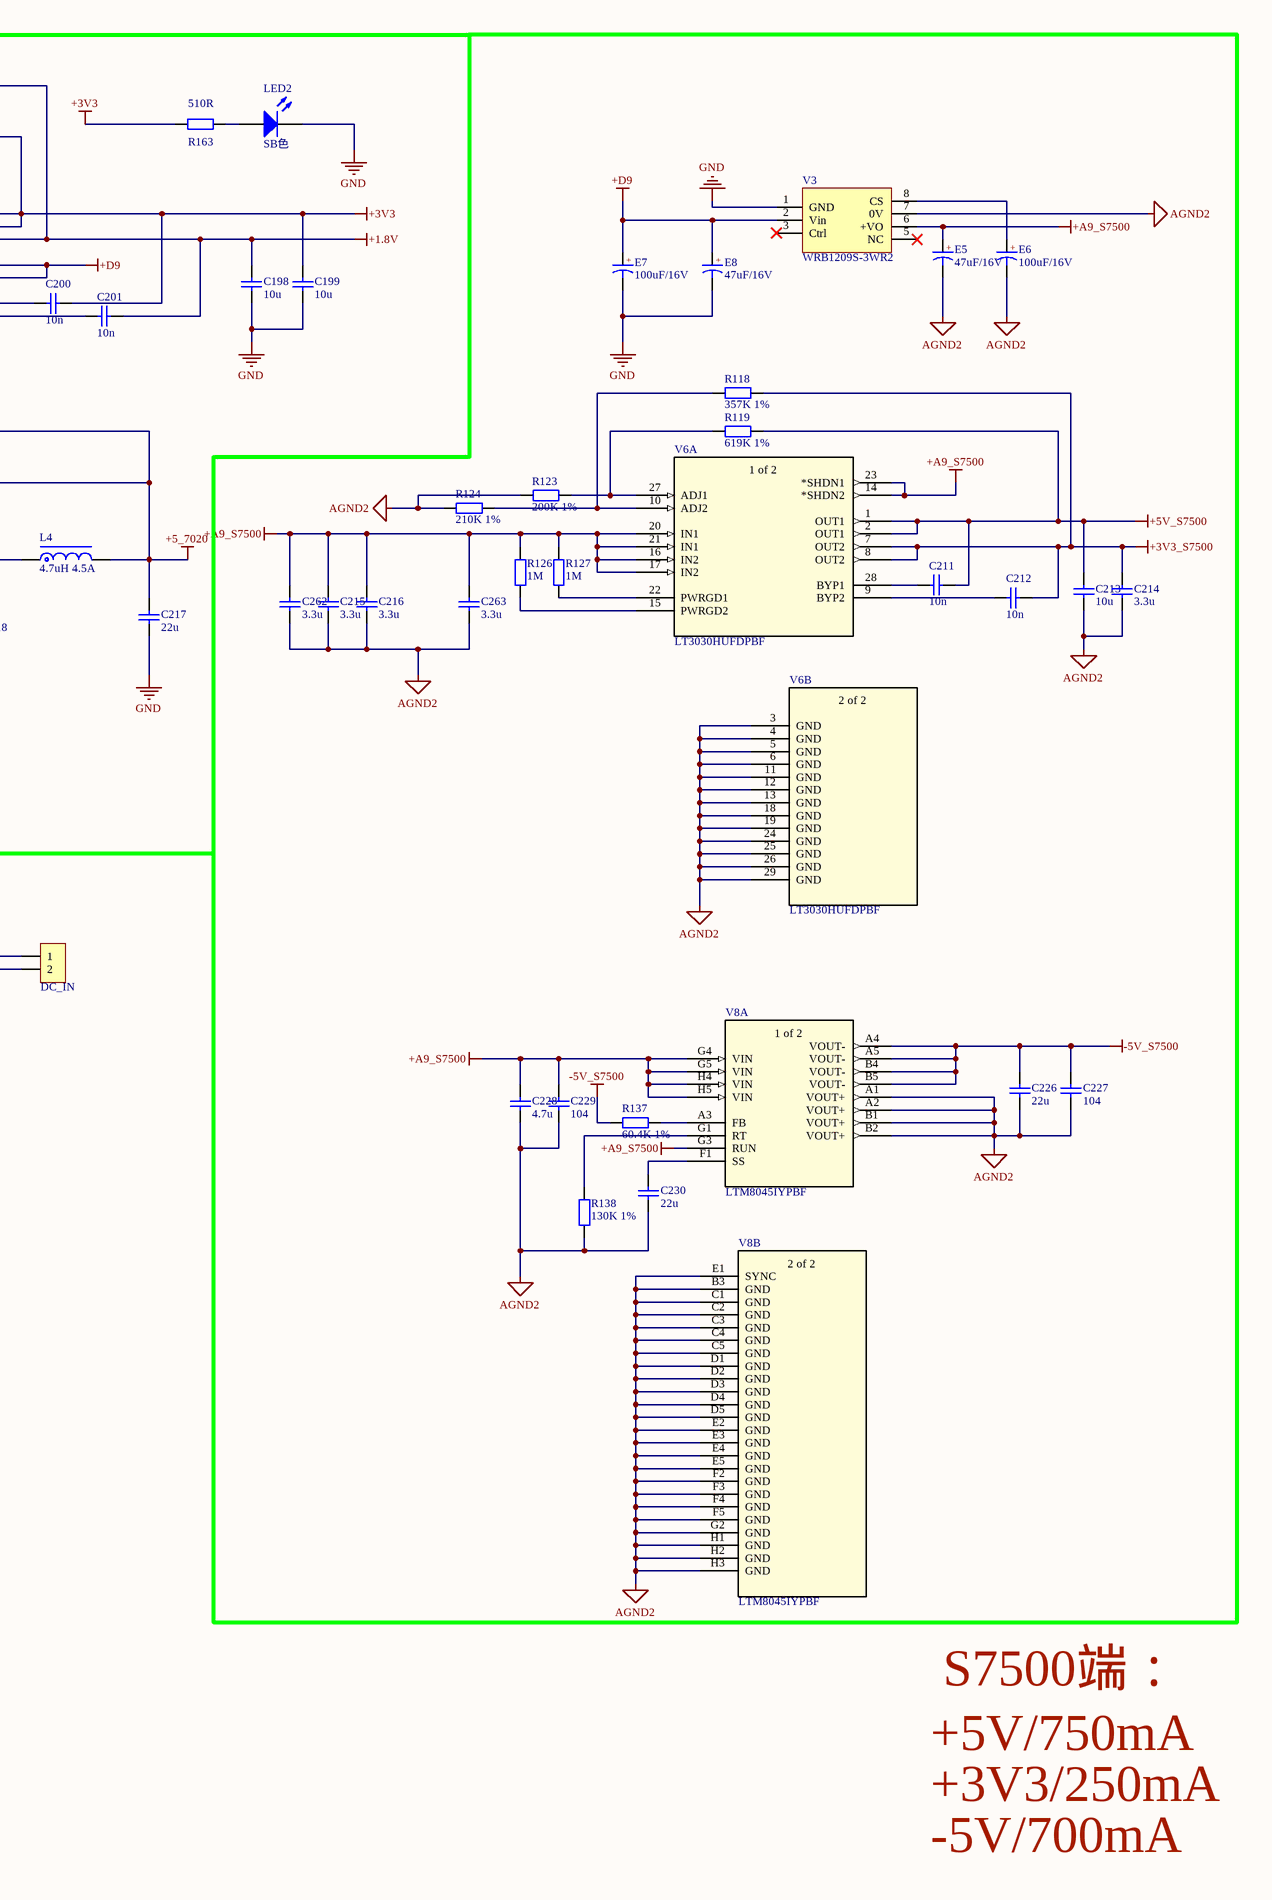
[diagram p10: PWR.SchDoc, right]

### Parts
C198  10u  [C0402_L]
C199  10u  [C0402_L]
C200  10n  [C0402_L]
C201  10n  [C0402_L]
C202  1u  [C0402_L]
C203  104  [C0402_L]
C204  10P  [C0402_L]
C205  10u  [C0402_L]
C206  10u  [C0402_L]
C207  10n  [C0402_L]
C208  10n  [C0402_L]
C209  1u  [C0402_L]
C210  104  [C0402_L]
C211  10n  [C0402_L]
C212  10n  [C0402_L]
C213  10u  [C0402_L]
C214  3.3u  [C0402_L]
C215  3.3u  [C0402_L]
C216  3.3u  [C0402_L]
C217  22u  [C0402_L]
C218  1u  [C0402_L]
C219  22u  [C0402_L]
C220  104  [C0402_L]
C221  4.7u  [C0402_L]
C222  4.7u  [C0402_L]
C223  1u  [C0402_L]
C224  2.2u  [C0402_L]
C225  2.2u  [C0402_L]
C226  22u  [C0402_L]
C227  104  [C0402_L]
C228  4.7u  [C0402_L]
C229  104  [C0402_L]
C230  22u  [C0402_L]
C261  104  [C0402_L]
C262  3.3u  [C0402_L]
C263  3.3u  [C0402_L]
DC_IN  HDR-1X2  [KF128-3.81-2P]  (value not drawn)
E1  47uF/16V  [C_6032]
E2  100uF/16V  [C_6032]
E3  100uF/16V  [C_6032]
E4  47uF/16V  [C_6032]
E5  47uF/16V  [C_6032]
E6  100uF/16V  [C_6032]
E7  100uF/16V  [C_6032]
E8  47uF/16V  [C_6032]
E10  10uF/16V  [C_3216]
L4  4.7uH 4.5A  [SWPA5020]
LED2  SB色  [LED0603_B]
R112  120K 1%  [R0402_L]
R113  422K 1%  [R0402_L]
R114  249K 1%  [R0402_L]
R115  249K 1%  [R0402_L]
R116  261K 1%  [R0402_L]
R117  422K 1%  [R0402_L]
R118  357K 1%  [R0402_L]
R119  619K 1%  [R0402_L]
R120  249K 1%  [R0402_L]
R121  249K 1%  [R0402_L]
R122  47K 1%  [R0402_L]
R123  200K 1%  [R0402_L]
R124  210K 1%  [R0402_L]
R125  100K  [R0402_L]
R126  1M  [R0402_L]
R127  1M  [R0402_L]
R128  40.2K 1%  [R0402_L]
R129  10R  [R0402_L]
R130  7.68K  [R0402_L]
R131  140K 1%  [R0402_L]
R132  4.7K  [R0402_L]
R133  10K  [R0402_L]
R134  60K 1%  [R0402_L]
R135  62K 1%  [R0402_L]
R136  140K 1%  [R0402_L]
R137  60.4K 1%  [R0402_L]
R138  130K 1%  [R0402_L]
R163  510R  [R0603_L]
V1  WRB1205S-3WR2  [WRB_S-3WR2]
V2  LT3024EDEPBF  [DFN-12_DE_LIT]
V3  WRB1209S-3WR2  [WRB_S-3WR2]
V4  LT3024EDEPBF  [DFN-12_DE_LIT]
V5  LM27762DSSR  [DSS0012B]
V6  LT3030HUFDPBF  [QFN-28_UFD_LIT]  (parts A,B of 2)
V7  MP1476LGTF-P  [SOT563_MP1476L_MNP]
V8  LTM8045IYPBF  [BGA-40_11P25X6P25_LIT]  (parts A,B of 2)

### Nets
+1.8V: C198.1 C201.2 R112.2 V2.5(OUT2)
+3V3: C199.1 C200.2 R113.2 R163.1 V2.2(OUT1) V2.3(OUT1)
+3V3_S7500: C212.2 C214.2 R118.2 V6.7(OUT2) V6.8(OUT2)
+5_7020: C204.2 C217.2 L4.2 R122.2
+5V_S7500: C211.2 C213.2 R119.2 V6.1(OUT1) V6.2(OUT1)
+A3V3_PD: C206.1 C207.2 R117.2 V4.2(OUT1) V4.3(OUT1)
+A4_PD: C224.2 R131.2 V5.11(OUT+)
+A5_PD: C209.1 C210.1 C222.1 E1.1(A) R132.2 R133.2 V1.6(+VO) V4.8(*SHDN2) V4.9(IN) V4.10(IN) V4.11(*SHDN1) V5.3(VIN)
+A9_S7500: C215.2 C216.2 C228.1 C229.1 C262.2 C263.2 E5.1(A) R126.2 R127.2 V3.6(+VO) V6.14(*SHDN2) V6.16(IN2) V6.17(IN2) V6.20(IN1) V6.21(IN1) V6.23(*SHDN1) V8.G3(RUN) V8.G4(VIN) V8.G5(VIN) V8.H4(VIN) V8.H5(VIN)
+D2V5_PD: C205.1 C208.2 R116.2 V4.5(OUT2)
+D9: C202.1 C203.1 C219.2 C220.2 C261.2 DC_IN.1 E3.1(A) E4.1(A) E7.1(A) E8.1(A) E10.1(A) R125.1 V1.2(Vin) V2.8(*SHDN2) V2.9(IN) V2.10(IN) V2.11(*SHDN1) V3.2(Vin) V7.1(VIN)
-5V_S7500: C226.1 C227.1 R137.1 V8.A4(VOUT-) V8.A5(VOUT-) V8.B4(VOUT-) V8.B5(VOUT-)
-A4_PD: C225.1 R136.1 V5.6(OUT-)
AGND1: C205.2 C206.2 C209.2 C210.2 C221.2 C222.2 C224.1 C225.2 E1.2(K) E2.2(K) R120.1 R121.1 R134.1 R135.2 V1.7(0V) V4.4(GND) V4.13(EPAD) V5.4(GND) V5.13(PAD)
AGND2: C213.1 C214.1 C215.1 C216.1 C226.2 C227.2 C228.2 C229.2 C230.2 C262.1 C263.1 E5.2(K) E6.2(K) R123.1 R124.1 R138.1 V3.7(0V) V6.3(GND) V6.4(GND) V6.5(GND) V6.6(GND) V6.11(GND) V6.12(GND) V6.13(GND) V6.18(GND) V6.19(GND) V6.24(GND) V6.25(GND) V6.26(GND) V6.29(GND) V8.A1(VOUT+) V8.A2(VOUT+) V8.B1(VOUT+) V8.B2(VOUT+) V8.B3(GND) V8.C1(GND) V8.C2(GND) V8.C3(GND) V8.C4(GND) V8.C5(GND) V8.D1(GND) V8.D2(GND) V8.D3(GND) V8.D4(GND) V8.D5(GND) V8.E1(SYNC) V8.E2(GND) V8.E3(GND) V8.E4(GND) V8.E5(GND) V8.F2(GND) V8.F3(GND) V8.F4(GND) V8.F5(GND) V8.G2(GND) V8.H1(GND) V8.H2(GND) V8.H3(GND)
GND: C198.2 C199.2 C202.2 C203.2 C217.1 C219.1 C220.1 C261.1 DC_IN.2 E3.2(K) E4.2(K) E7.2(K) E8.2(K) E10.2(K) LED2.2(K) R114.1 R115.1 R130.1 V1.1(GND) V2.4(GND) V2.13(EPAD) V3.1(GND) V7.3(GND)
NetC200_1: C200.1 V2.1(BYP1)
NetC201_1: C201.1 V2.6(BYP2)
NetC204_1: C204.1 R122.1 R128.1 R130.2
NetC207_1: C207.1 V4.1(BYP1)
NetC208_1: C208.1 V4.6(BYP2)
NetC211_1: C211.1 V6.28(BYP1)
NetC212_1: C212.1 V6.9(BYP2)
NetC218_1: C218.1 R129.1
NetC218_2: C218.2 L4.1 V7.2(SW)
NetC221_1: C221.1 V5.5(CPOUT)
NetC223_1: C223.1 V5.9(C1-)
NetC223_2: C223.2 V5.10(C1+)
NetC230_1: C230.1 V8.F1(SS)
NetE2_1: E2.1(A) V1.8(CS)
NetE6_1: E6.1(A) V3.8(CS)
NetLED2_1: LED2.1(A) R163.2
NetR112_1: R112.1 R115.2 V2.7(ADJ2)
NetR113_1: R113.1 R114.2 V2.12(ADJ1)
NetR116_1: R116.1 R121.2 V4.7(ADJ2)
NetR117_1: R117.1 R120.2 V4.12(ADJ1)
NetR118_1: R118.1 R124.2 V6.10(ADJ2)
NetR119_1: R119.1 R123.2 V6.27(ADJ1)
NetR125_2: R125.2 V7.5(EN)
NetR126_1: R126.1 V6.15(PWRGD2)
NetR127_1: R127.1 V6.22(PWRGD1)
NetR128_2: R128.2 V7.6(FB)
NetR129_2: R129.2 V7.4(BST)
NetR131_1: R131.1 R134.2 V5.2(FB+)
NetR132_1: R132.1 V5.8(EN-) V5.12(EN+)
NetR133_1: R133.1 V5.1(PGOOD)
NetR135_1: R135.1 R136.2 V5.7(FB-)
NetR137_2: R137.2 V8.A3(FB)
NetR138_2: R138.2 V8.G1(RT)

Not connected (* = marked no-connect by the designer): V1 3(Ctrl)* 5(NC)*; V3 3(Ctrl)* 5(NC)*

### Notes on the sheet
- 数字端：
- 3V3/500mA
- 1V8/100mA
- 5V/2A
- PD端：
- 2v5/100mA
- ±4V/250mA
- S7500端：
- +5V/750mA
- +3V3/250mA
- -5V/700mA
- (in symbol CT) +
- (in symbol LT3030HUFDPBF, part A) 1 of 2
- (in symbol LT3030HUFDPBF, part B) 2 of 2
- (in symbol LTM8045IYPBF, part A) 1 of 2
- (in symbol LTM8045IYPBF, part B) 2 of 2

### Library data of the parts
C198-C230 C261-C263 = C: as C1 on sheet S7500_Drv
DC_IN = Header 2: 2P接插件; 当前库版本V2022.10.7 @淘宝卖家:黄晶宝石: 最新版本发布https://shop463601444.taobao.com; BOM名称: 2P接插件
E1-E8 E10 = CT: 贴片钽电容; 当前库版本V2023.5.31 @淘宝卖家:黄晶宝石: 最新版本发布https://item.taobao.com/item.htm?id=566775463719; BOM名称: 贴片钽电容
L4 = L-SWPA: as L3 on sheet S7500_Drv
LED2 = LED: as LED1 on sheet CORE; BOM名称: 贴片LED
R112-R138 R163 = R: 贴片电阻; 联系下单店铺卖家 免费帮你查找封装: 联系下单店铺卖家 免费技术支持; BOM名称: 贴片电阻
V1 V3 = WRB_S-3WR2
V2 V4 = LT3024EDEPBF: No Description Available; Mfr_Name: Analog Devices Inc; RefDes: RefDes; Type: Type
V5 = LM27762DSSR: No Description Available; Mfr_Name: Texas Instruments; Type: DEV; RefDes: RefDes; Copyright: Copyright (C) 2023 Ultra Librarian. All rights reserved.; Manufacturer_Part_Number: LM27762DSSR
V6 = LT3030HUFDPBF: No Description Available; Mfr_Name: Analog Devices Inc; RefDes: RefDes; Type: Type
V7 = MP1476LGTF-P: No Description Available; Mfr_Name: Monolithic Power Systems; RefDes: RefDes; Type: Type
V8 = LTM8045IYPBF: No Description Available; Mfr_Name: Analog Devices Inc; RefDes: RefDes; Type: Type

## Sheet USB_HOST.SchDoc
size A4; SheetNumber: 5; SheetTotal: 6
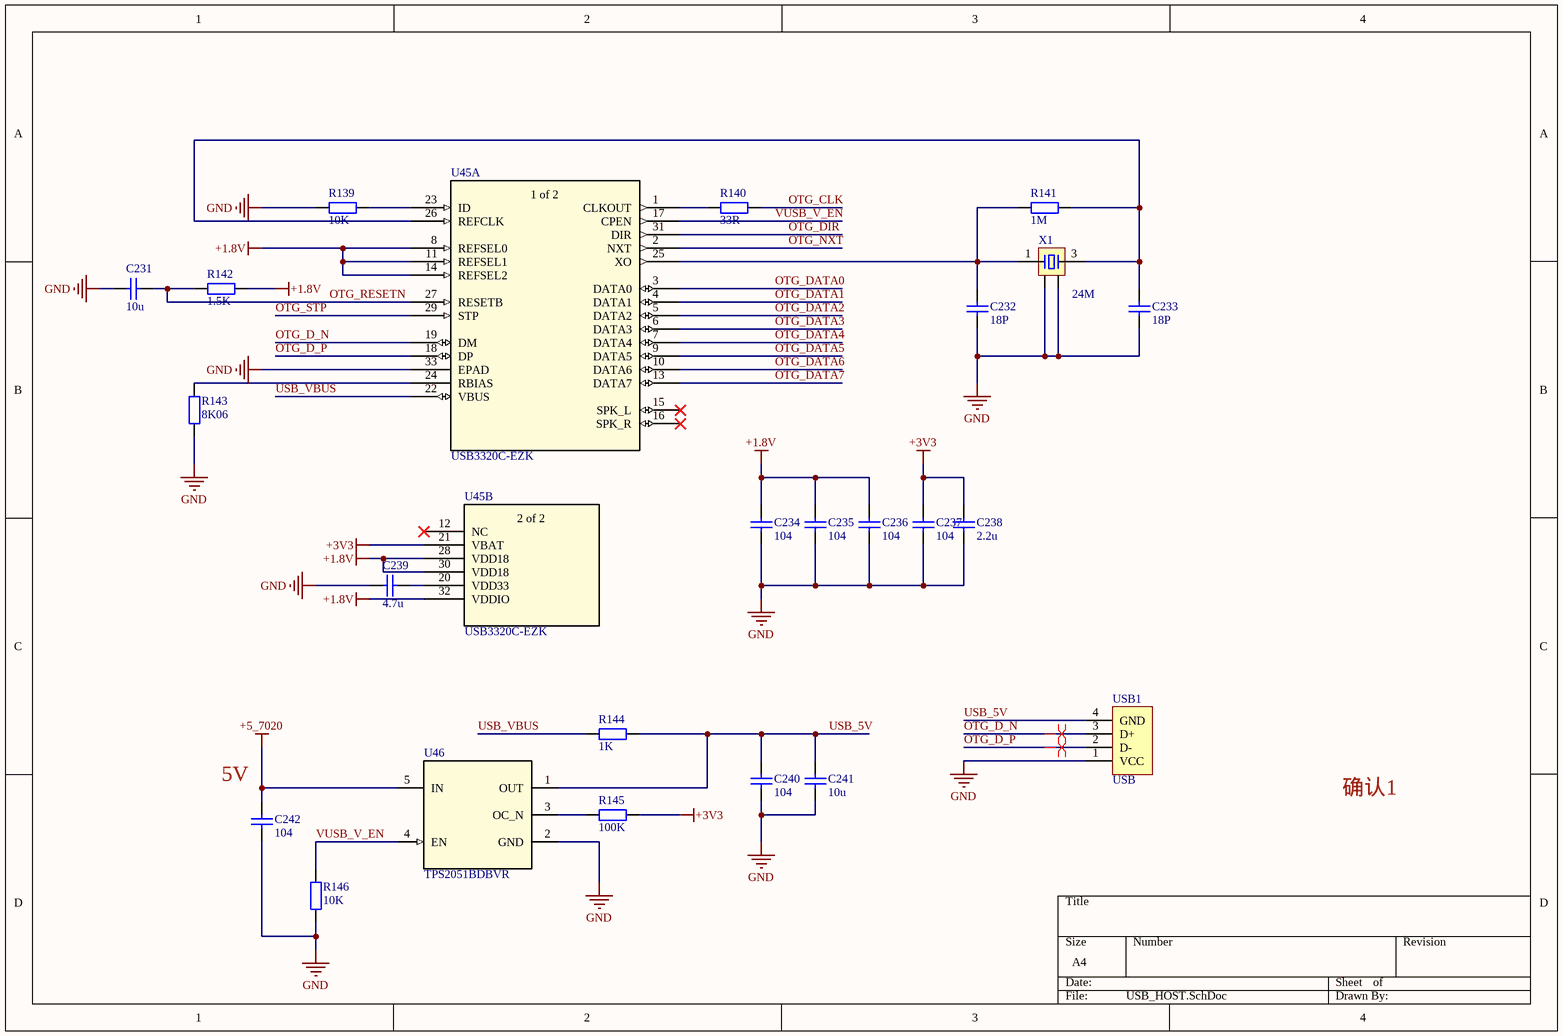
[diagram p11: USB_HOST.SchDoc]

### Parts
C231  10u  [C0402_L]
C232  18P  [C0402_L]
C233  18P  [C0402_L]
C234  104  [C0402_L]
C235  104  [C0402_L]
C236  104  [C0402_L]
C237  104  [C0402_L]
C238  2.2u  [C0402_L]
C239  4.7u  [C0402_L]
C240  104  [C0402_L]
C241  10u  [C0402_L]
C242  104  [C0402_L]
R139  10K  [R0402_L]
R140  33R  [R0402_L]
R141  1M  [R0402_L]
R142  1.5K  [R0402_L]
R143  8K06  [R0402_L]
R144  1K  [R0402_L]
R145  100K  [R0402_L]
R146  10K  [R0402_L]
U45  USB3320C-EZK  [QFN32_5X5MC_MCH]  (parts A,B of 2)
U46  TPS2051BDBVR  [DBV0005A_N]
USB1  USB  [USB2.0_Type-A_DIP_F_3]
X1  24M  [XTAL-2025-4P]

### Nets
+1.8V: C234.2 C235.2 C236.2 R142.2 U45.8(REFSEL0) U45.11(REFSEL1) U45.14(REFSEL2) U45.28(VDD18) U45.30(VDD18) U45.32(VDDIO)
+3V3: C237.2 C238.2 R145.1 U45.21(VBAT)
+5_7020: C242.2 U46.5(IN)
GND: C231.1 C232.1 C233.1 C234.1 C235.1 C236.1 C237.1 C238.1 C239.1 C240.1 C241.1 C242.1 R139.2 R143.1 R146.2 U45.33(EPAD) U46.2(GND) USB1.1(VCC) X1.2 X1.4
OTG_CLK: R140.1
OTG_D_N: U45.19(DM) USB1.3(D+)
OTG_D_P: U45.18(DP) USB1.2(D-)
OTG_DATA0: U45.3(DATA0)
OTG_DATA1: U45.4(DATA1)
OTG_DATA2: U45.5(DATA2)
OTG_DATA3: U45.6(DATA3)
OTG_DATA4: U45.7(DATA4)
OTG_DATA5: U45.9(DATA5)
OTG_DATA6: U45.10(DATA6)
OTG_DATA7: U45.13(DATA7)
OTG_DIR: U45.31(DIR)
OTG_NXT: U45.2(NXT)
OTG_RESETN: C231.2 R142.1 U45.27(RESETB)
OTG_STP: U45.29(STP)
USB_5V: C240.2 C241.2 R144.1 U46.1(OUT) USB1.4(GND)
USB_VBUS: R144.2 U45.22(VBUS)
VUSB_V_EN: R146.1 U45.17(CPEN) U46.4(EN)
NetC232_2: C232.2 R141.2 U45.25(XO) X1.1
NetC233_2: C233.2 R141.1 U45.26(REFCLK) X1.3
NetC239_2: C239.2 U45.20(VDD33)
NetR139_1: R139.1 U45.23(ID)
NetR140_2: R140.2 U45.1(CLKOUT)
NetR143_2: R143.2 U45.24(RBIAS)
NetR145_2: R145.2 U46.3(OC_N)

Not connected (* = marked no-connect by the designer): U45 12(NC)* 15(SPK_L)* 16(SPK_R)*

### Layout directives
differential pair: OTG_D_N, OTG_D_P

### Notes on the sheet
- (near C242) 5V
- 确认1
- (in symbol USB3320C-EZK, part A) 1 of 2
- (in symbol USB3320C-EZK, part B) 2 of 2

### Library data of the parts
C231-C242 = C: as C1 on sheet S7500_Drv
R139-R146 = R: 贴片电阻; 联系下单店铺卖家 免费帮你查找封装: 联系下单店铺卖家 免费技术支持; BOM名称: 贴片电阻
U45 = USB3320C-EZK: No Description Available; Mfr_Name: Microchip; RefDes: RefDes; Type: Type
U46 = TPS2051BDBVR: No Description Available; Mfr_Name: Texas Instruments; Alternate_PartNumber: TPS2051BDBVT; CompType: IC; TYPE: TYPE; RefDes: RefDes; Application_BuildNumber: *; PartNumber: TPS2051BDBVR; PackageReference: DBV0005A; MountType: SMT; RoHS: Y; Manufacturer: Texas Instruments
USB1 = USB2.0_Type-A_F: USB2.0_Type-A母座; 联系下单店铺卖家 免费技术支持: 联系下单店铺卖家 免费帮你查找封装; BOM名称: USB2.0_Type-A母座
X1 = XTAL-4P: 4脚无源晶振(谐振器）; 联系下单店铺卖家 免费帮你查找封装: 联系下单店铺卖家 免费技术支持; BOM名称: 4脚无源晶振(谐振器）

## Sheet NET&232&USART&SD&FLASH.SchDoc
size A3; SheetNumber: 6; SheetTotal: 6
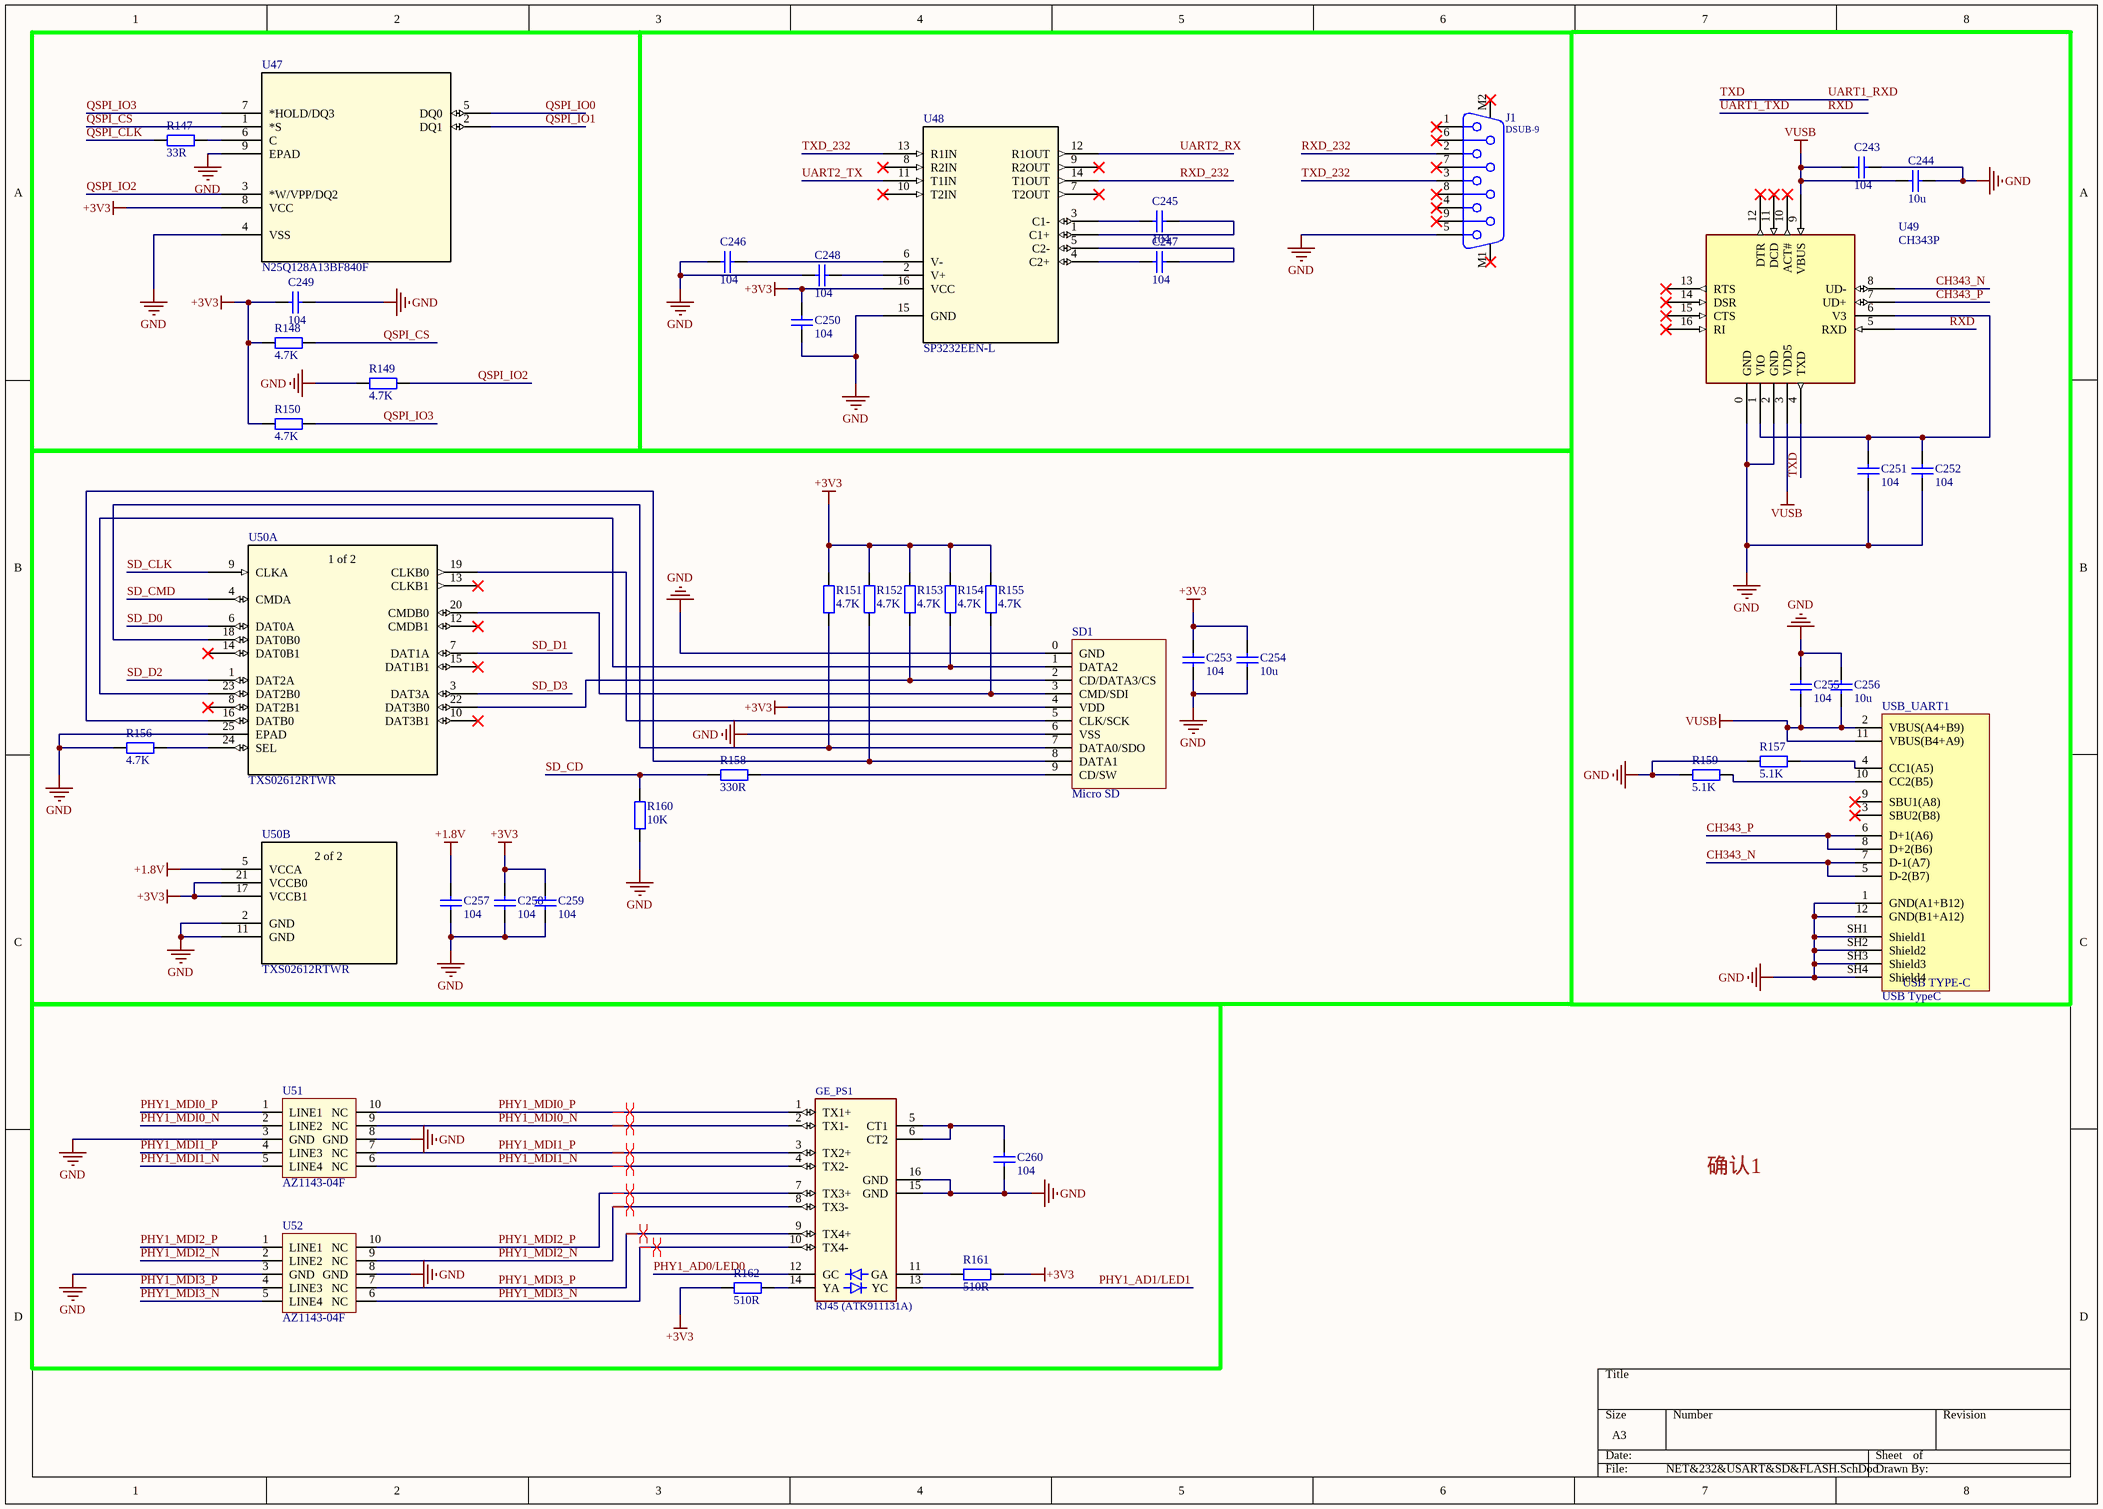
[diagram p12: NET&232&USART&SD&FLASH.SchDoc]

### Parts
C243  104  [C0402_L]
C244  10u  [C0402_L]
C245  104  [C0402_L]
C246  104  [C0402_L]
C247  104  [C0402_L]
C248  104  [C0402_L]
C249  104  [C0402_L]
C250  104  [C0402_L]
C251  104  [C0402_L]
C252  104  [C0402_L]
C253  104  [C0402_L]
C254  10u  [C0402_L]
C255  104  [C0402_L]
C256  10u  [C0402_L]
C257  104  [C0402_L]
C258  104  [C0402_L]
C259  104  [C0402_L]
C260  104  [C0402_L]
GE_PS1  RJ45 (ATK911131A)  [HR911131A]
J1  DSUB-9  [DB-9-H]
R147  33R  [R0402_L]
R148  4.7K  [R0402_L]
R149  4.7K  [R0402_L]
R150  4.7K  [R0402_L]
R151  4.7K  [R0402_L]
R152  4.7K  [R0402_L]
R153  4.7K  [R0402_L]
R154  4.7K  [R0402_L]
R155  4.7K  [R0402_L]
R156  4.7K  [R0402_L]
R157  5.1K  [R0402_L]
R158  330R  [R0402_L]
R159  5.1K  [R0402_L]
R160  10K  [R0402_L]
R161  510R  [R0402_L]
R162  510R  [R0402_L]
SD1  Micro SD  [Micro SD]
U47  N25Q128A13BF840F  [VDFPN8_8X6_MRN]
U48  SP3232EEN-L  [NSOIC-16_MXL]
U49  CH343P  [QFN16_3X3]
U50  TXS02612RTWR  [RTW24_2P45X2P45]  (parts A,B of 2)
U51  AZ1143-04F  [DFN2510P10E]
U52  AZ1143-04F  [DFN2510P10E]
USB_UART1  USB TypeC  [USB Type-C]

### Nets
+1.8V: C257.1 U50.5(VCCA)
+3V3: C249.2 C250.1 C253.1 C254.1 C258.1 C259.1 R148.2 R150.2 R151.1 R152.1 R153.1 R154.1 R155.1 R161.2 R162.1 SD1.4(VDD) U47.8(VCC) U48.16(VCC) U50.17(VCCB1) U50.21(VCCB0)
GND: C243.2 C244.2 C246.2 C248.2 C249.1 C250.2 C251.1 C252.1 C253.2 C254.2 C255.2 C256.2 C257.2 C258.2 C259.2 C260.2 GE_PS1.15(GND) GE_PS1.16(GND) J1.5 R149.2 R156.2 R157.1 R159.1 R160.2 SD1.0(GND) SD1.6(VSS) U47.4(VSS) U47.9(EPAD) U48.15(GND) U49.0(GND) U49.2(GND) U50.2(GND) U50.11(GND) U50.25(EPAD) U51.3(GND) U51.8(GND) U52.3(GND) U52.8(GND) USB_UART1.1(GND(A1+B12)) USB_UART1.12(GND(B1+A12)) USB_UART1.SH1(Shield1) USB_UART1.SH2(Shield2) USB_UART1.SH3(Shield3) USB_UART1.SH4(Shield4)
VUSB: C243.1 C244.1 C255.1 C256.1 U49.3(VDD5) U49.9(VBUS) USB_UART1.2(VBUS(A4+B9)) USB_UART1.11(VBUS(B4+A9))
CH343_N: U49.8(UD-) USB_UART1.5(D-2(B7)) USB_UART1.7(D-1(A7))
CH343_P: U49.7(UD+) USB_UART1.6(D+1(A6)) USB_UART1.8(D+2(B6))
PHY1_AD0/LED0: GE_PS1.12(GC)
PHY1_AD1/LED1: GE_PS1.13(YC)
PHY1_MDI0_N: GE_PS1.2(TX1-) U51.2(LINE2) U51.9(NC)
PHY1_MDI0_P: GE_PS1.1(TX1+) U51.1(LINE1) U51.10(NC)
PHY1_MDI1_N: GE_PS1.4(TX2-) U51.5(LINE4) U51.6(NC)
PHY1_MDI1_P: GE_PS1.3(TX2+) U51.4(LINE3) U51.7(NC)
PHY1_MDI2_N: GE_PS1.8(TX3-) U52.2(LINE2) U52.9(NC)
PHY1_MDI2_P: GE_PS1.7(TX3+) U52.1(LINE1) U52.10(NC)
PHY1_MDI3_N: GE_PS1.10(TX4-) U52.5(LINE4) U52.6(NC)
PHY1_MDI3_P: GE_PS1.9(TX4+) U52.4(LINE3) U52.7(NC)
QSPI_CLK: R147.2
QSPI_CS: R148.1 U47.1(*S)
QSPI_IO0: U47.5(DQ0)
QSPI_IO1: U47.2(DQ1)
QSPI_IO2: R149.1 U47.3(*W/VPP/DQ2)
QSPI_IO3: R150.1 U47.7(*HOLD/DQ3)
RXD: U49.5(RXD)  [also labelled UART1_TXD]
RXD_232: J1.2 U48.14(T1OUT)
SD_CD: R158.2 R160.1
SD_CLK: U50.9(CLKA)
SD_CMD: U50.4(CMDA)
SD_D0: U50.6(DAT0A)
SD_D1: U50.7(DAT1A)
SD_D2: U50.1(DAT2A)
SD_D3: U50.3(DAT3A)
TXD: U49.4(TXD)  [also labelled UART1_RXD]
TXD_232: J1.3 U48.13(R1IN)
UART2_RX: U48.12(R1OUT)
UART2_TX: U48.11(T1IN)
NetC245_1: C245.1 U48.1(C1+)
NetC245_2: C245.2 U48.3(C1-)
NetC246_1: C246.1 U48.6(V-)
NetC247_1: C247.1 U48.5(C2-)
NetC247_2: C247.2 U48.4(C2+)
NetC248_1: C248.1 U48.2(V+)
NetC251_2: C251.2 C252.2 U49.1(VIO) U49.6(V3)
NetC260_1: C260.1 GE_PS1.5(CT1) GE_PS1.6(CT2)
NetGE_PS1_11: GE_PS1.11(GA) R161.1
NetGE_PS1_14: GE_PS1.14(YA) R162.2
NetR147_1: R147.1 U47.6(C)
NetR151_2: R151.2 SD1.7(DATA0/SDO) U50.18(DAT0B0)
NetR152_2: R152.2 SD1.8(DATA1) U50.16(DATB0)
NetR153_2: R153.2 SD1.2(CD/DATA3/CS) U50.22(DAT3B0)
NetR154_2: R154.2 SD1.1(DATA2) U50.23(DAT2B0)
NetR155_2: R155.2 SD1.3(CMD/SDI) U50.20(CMDB0)
NetR156_1: R156.1 U50.24(SEL)
NetR157_2: R157.2 USB_UART1.4(CC1(A5))
NetR158_1: R158.1 SD1.9(CD/SW)
NetR159_2: R159.2 USB_UART1.10(CC2(B5))
NetSD1_5: SD1.5(CLK/SCK) U50.19(CLKB0)

Not connected (* = marked no-connect by the designer): J1 1* 4* 6* 7* 8* 9* M1* M2*; U48 7(T2OUT)* 8(R2IN)* 9(R2OUT)* 10(T2IN)*; U49 10(ACT#)* 11(DCD)* 12(DTR)* 13(RTS)* 14(DSR)* 15(CTS)* 16(RI)*; U50 8(DAT2B1)* 10(DAT3B1)* 12(CMDB1)* 13(CLKB1)* 14(DAT0B1)* 15(DAT1B1)*; USB_UART1 3(SBU2(B8))* 9(SBU1(A8))*

### Layout directives
differential pair: PHY1_MDI0_N, PHY1_MDI0_P, PHY1_MDI1_N, PHY1_MDI1_P, PHY1_MDI2_N, PHY1_MDI2_P, PHY1_MDI3_N, PHY1_MDI3_P

### Notes on the sheet
- 确认1
- (in symbol TXS02612RTWR, part A) 1 of 2
- (in symbol TXS02612RTWR, part B) 2 of 2
- (in symbol USB Type-C) USB TYPE-C

### Library data of the parts
C243-C260 = C: as C1 on sheet S7500_Drv
GE_PS1 = HR911131A/C_1: 千兆以太网接口
J1 = DSUB-9: DSUB-9Pin母座; 当前库版本V2023.5.31 @淘宝卖家:黄晶宝石: 最新版本发布https://shop463601444.taobao.com
R147-R162 = R: 贴片电阻; 联系下单店铺卖家 免费帮你查找封装: 联系下单店铺卖家 免费技术支持; BOM名称: 贴片电阻
SD1 = Micro SD: Micro SD卡; 版权归属: 源创客; BOM名称: Micro SD卡; 学习资源: www.ooocke.com
U47 = N25Q128A13BF840F: No Description Available; Mfr_Name: Micron; RefDes: RefDes; Type: Type
U48 = SP3232EEN-L: No Description Available; Mfr_Name: MaxLinear; RefDes: RefDes; Type: Type
U49 = CH343P: USB to high speed enhanced TTL Serial / UART
U50 = TXS02612RTWR: No Description Available; Mfr_Name: Texas Instruments; RefDes: RefDes; Type: Type
U51 U52 = AZ1143-04F: ESD保护二极管阵列
USB_UART1 = USB Type-C: 12P TypeC 母座